# EAGLE design TeensyBreakout_Alpha2a (EAGLE 9.6.2)
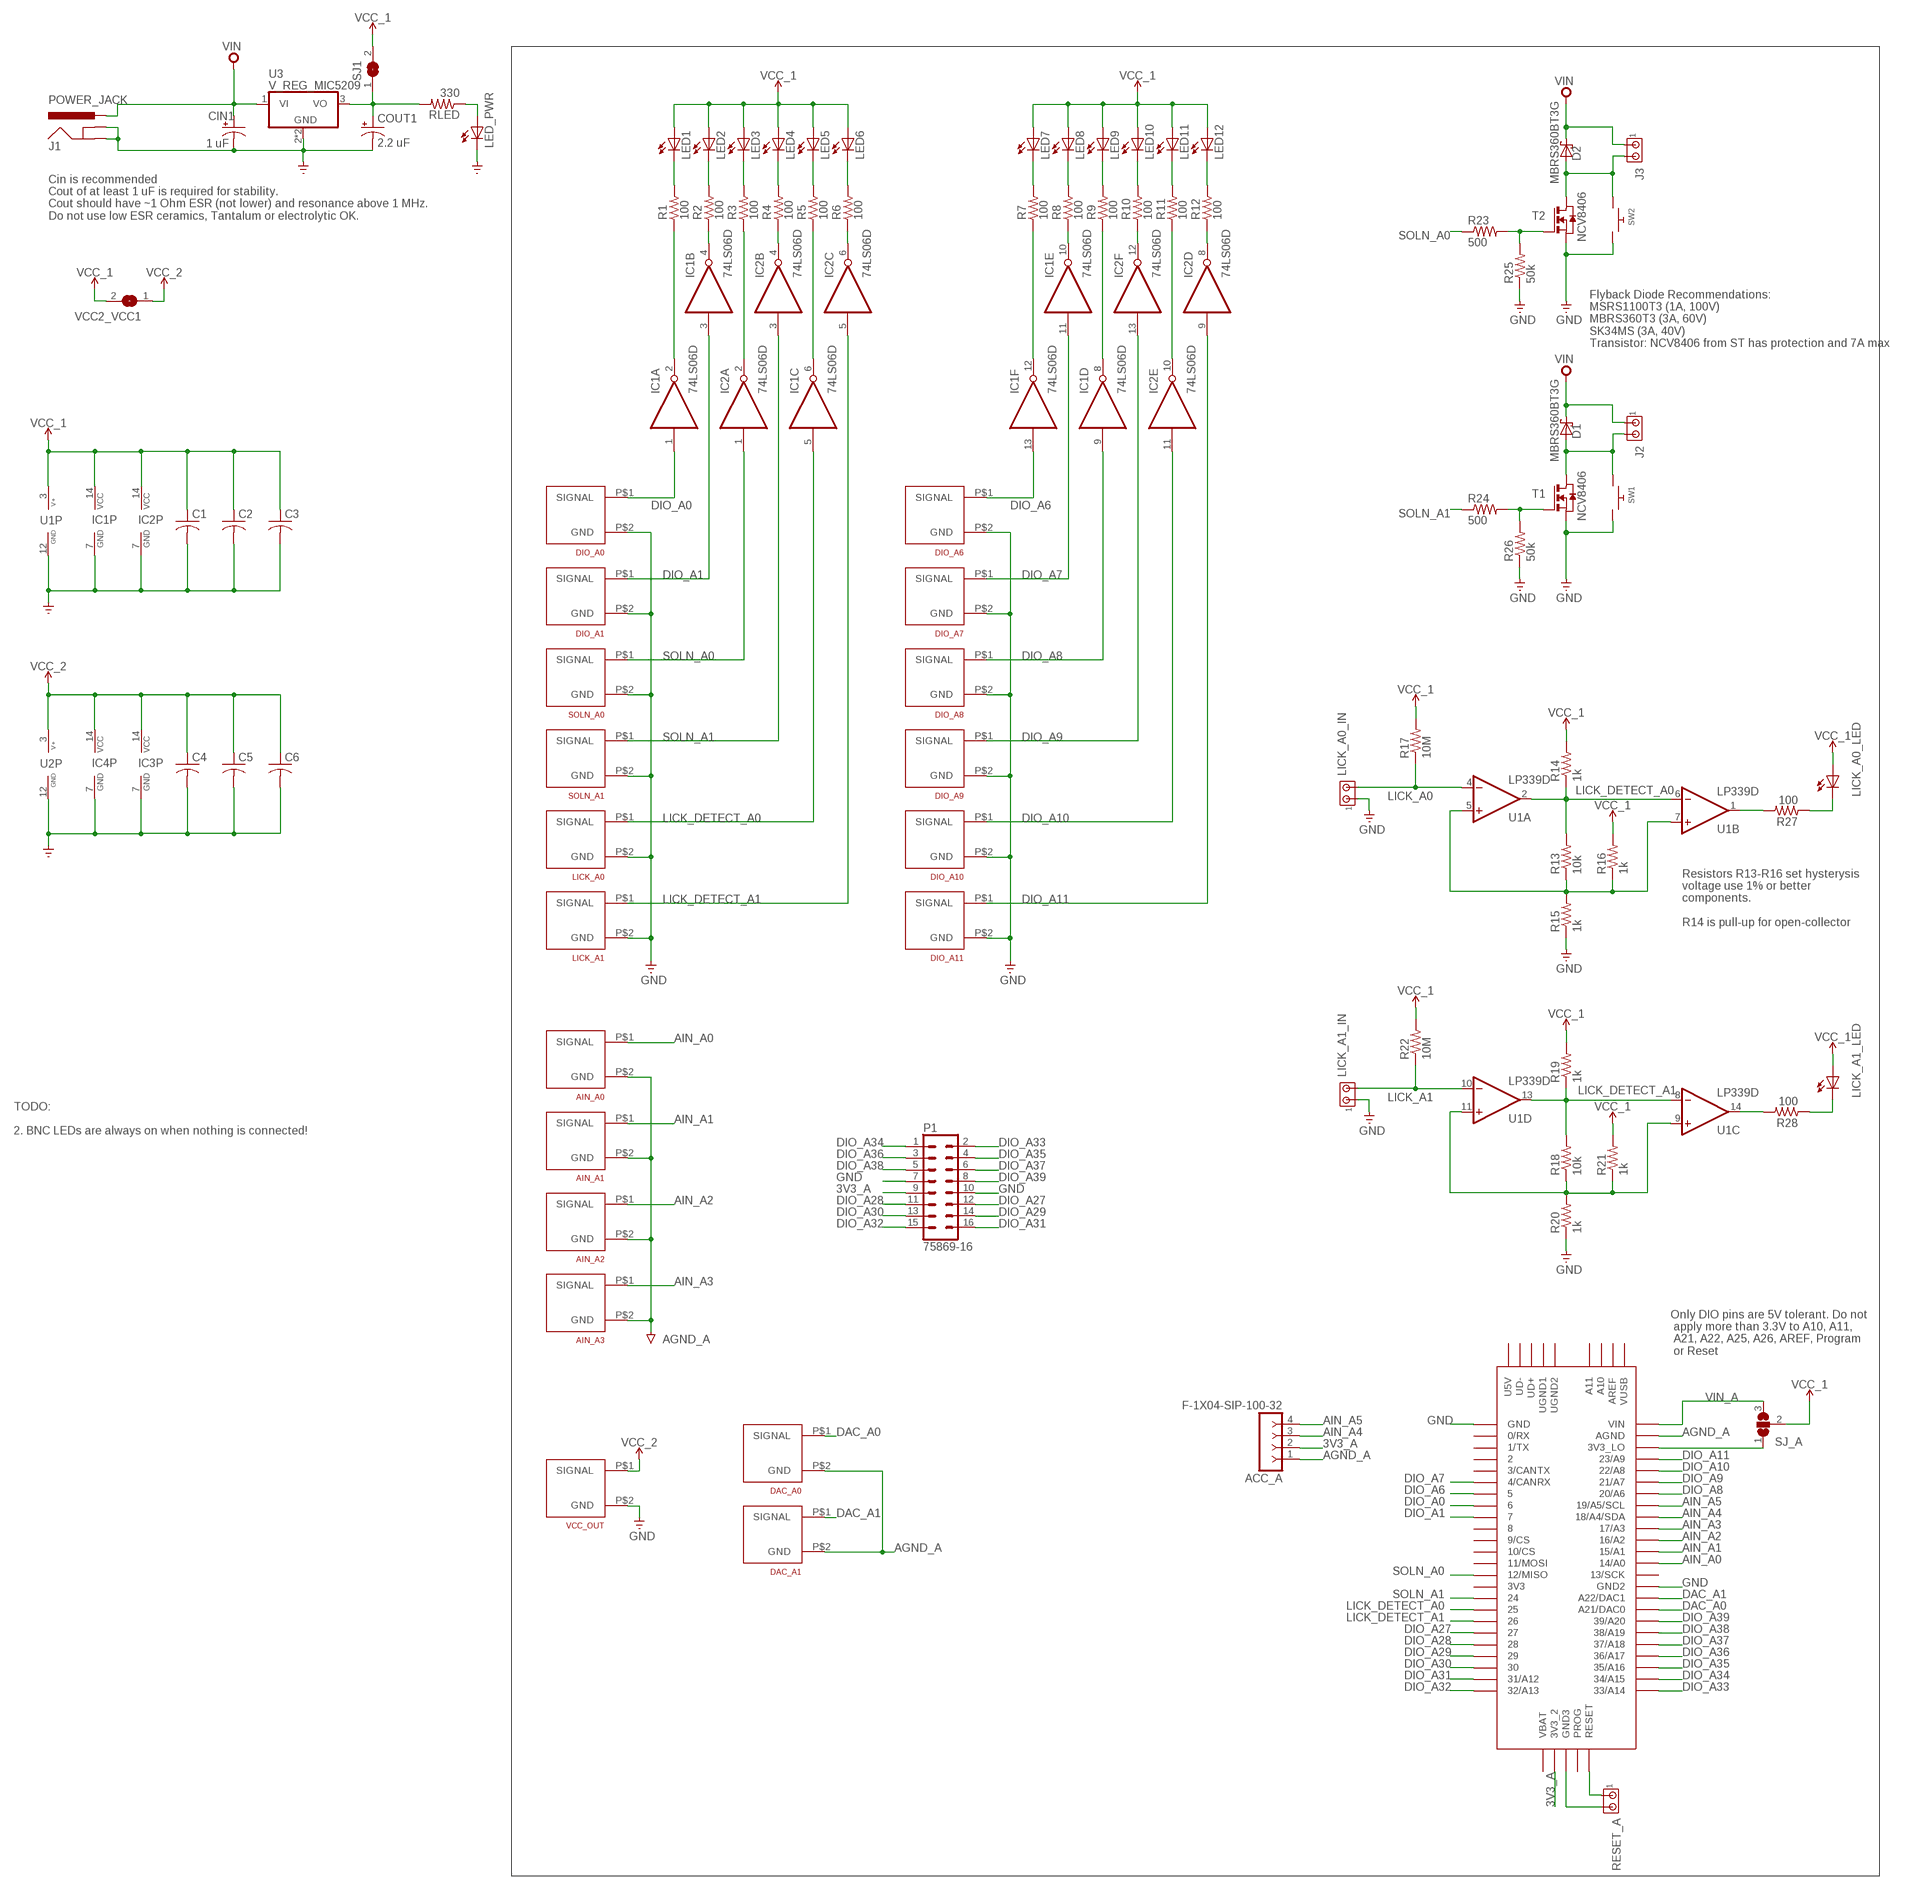
[diagram p0: schematic, sheet 1, part 1 of 2]
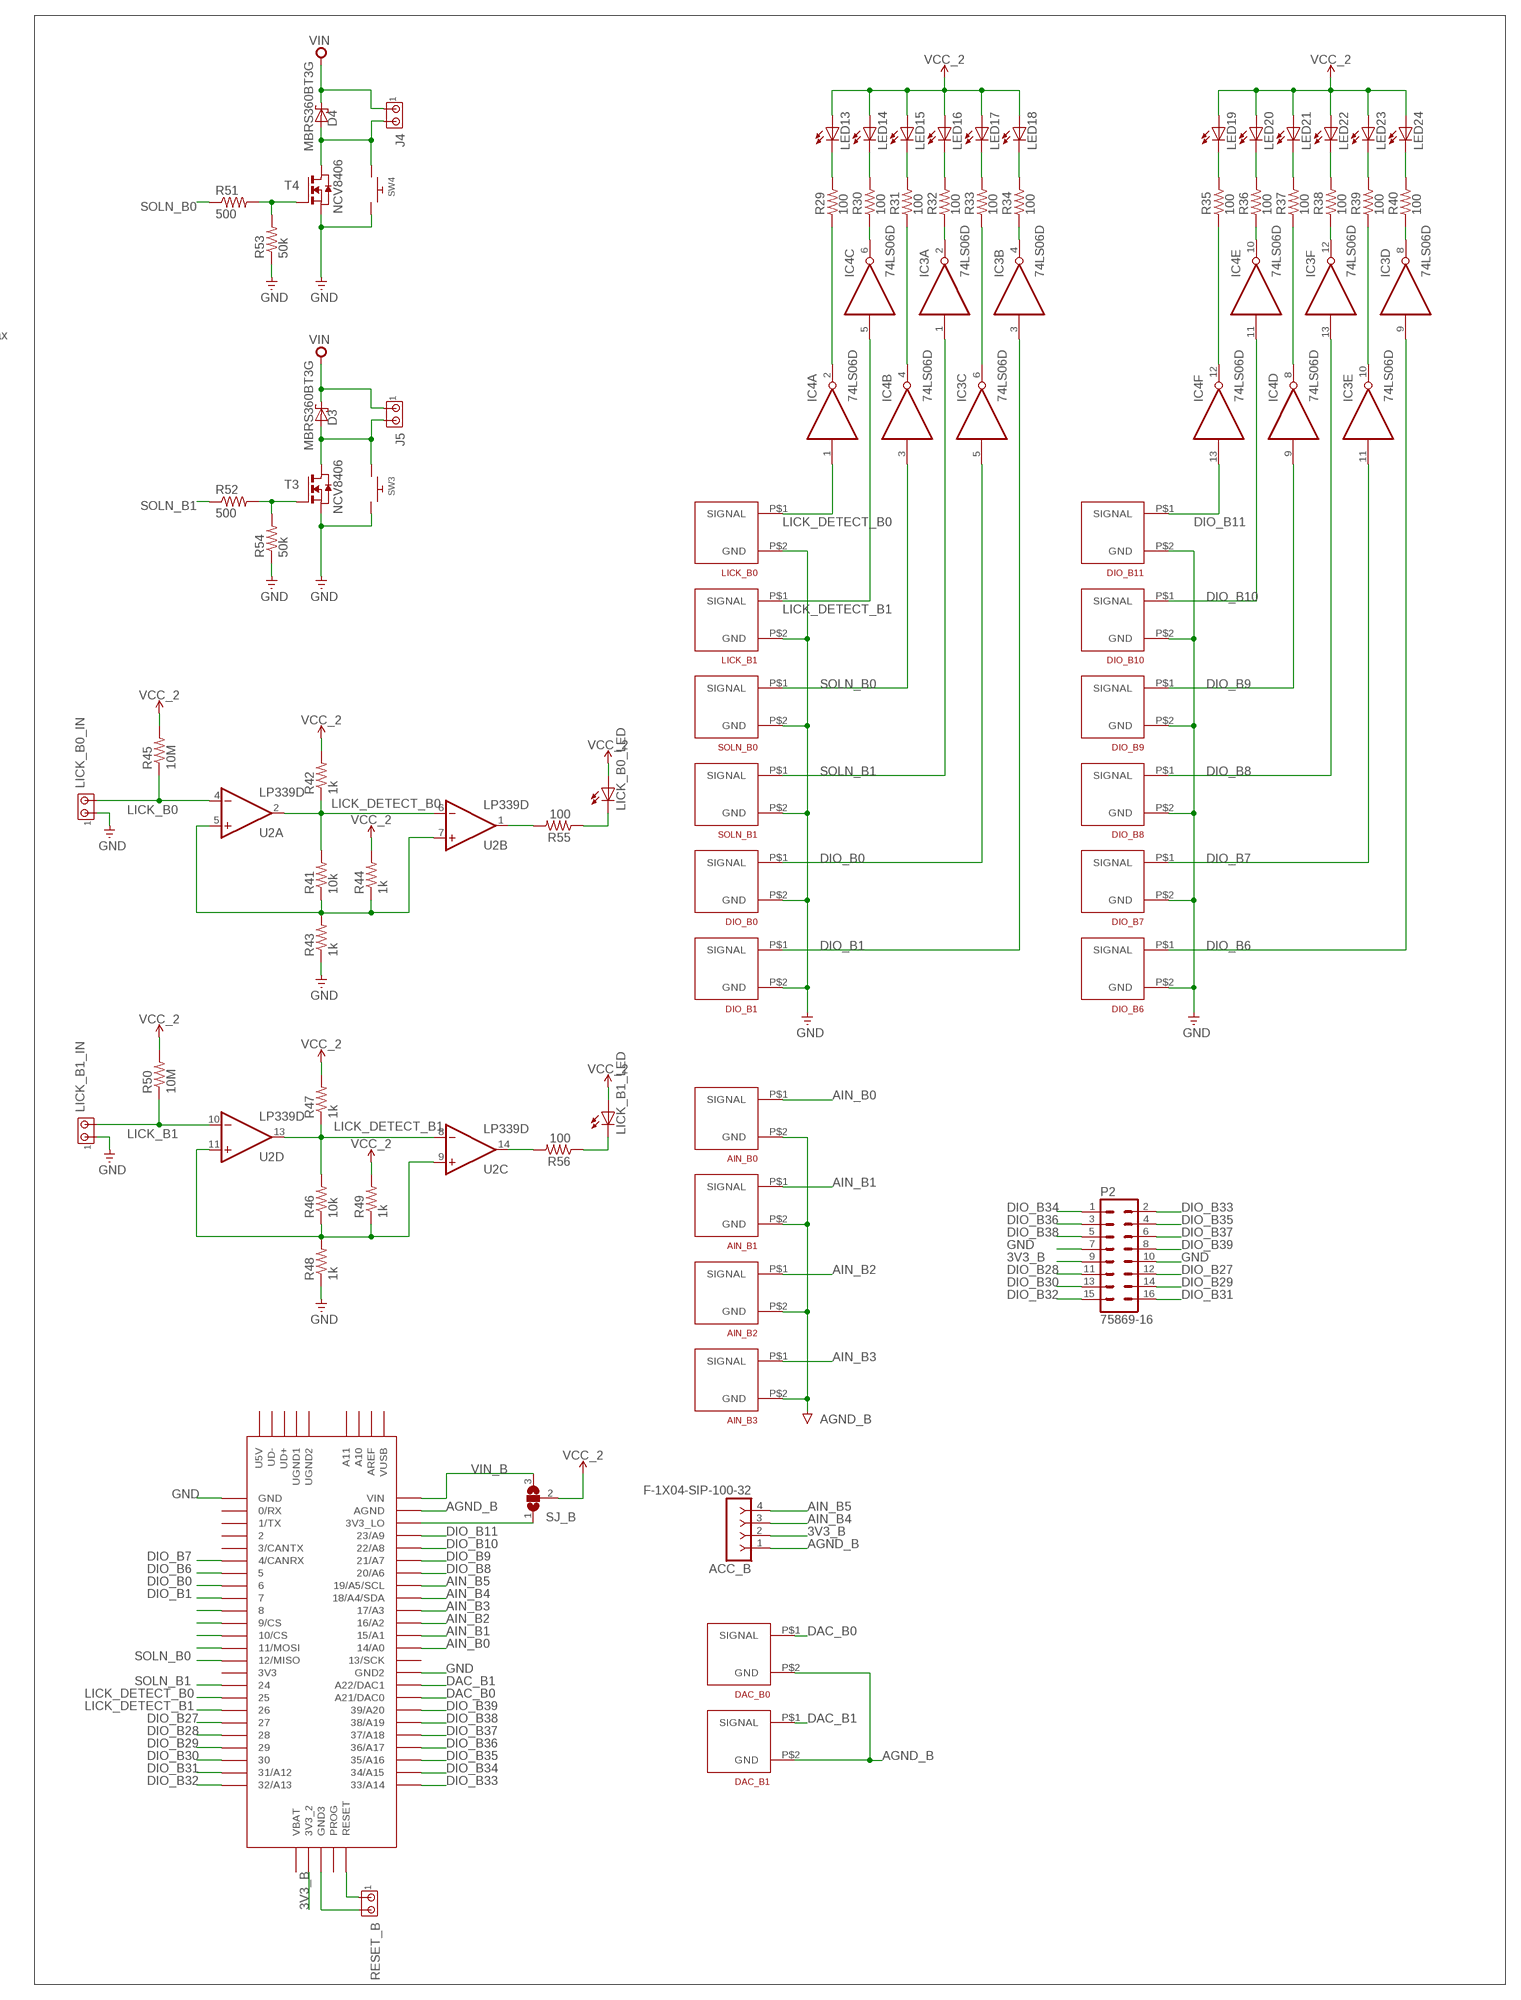
[diagram p1: schematic, sheet 1, part 2 of 2]

## Parts
ACC_A  F-1X04-SIP-100-32  [SIP-100-04-32]
ACC_B  F-1X04-SIP-100-32  [SIP-100-04-32]
AIN_A0  BNC_VERTICAL  [BNC_VERTICAL]
AIN_A1  BNC_VERTICAL  [BNC_VERTICAL]
AIN_A2  BNC_VERTICAL  [BNC_VERTICAL]
AIN_A3  BNC_VERTICAL  [BNC_VERTICAL]
AIN_B0  BNC_VERTICAL  [BNC_VERTICAL]
AIN_B1  BNC_VERTICAL  [BNC_VERTICAL]
AIN_B2  BNC_VERTICAL  [BNC_VERTICAL]
AIN_B3  BNC_VERTICAL  [BNC_VERTICAL]
C1  C-USC0805K  [C0805K]
C2  C-USC0805K  [C0805K]
C3  C-USC0805K  [C0805K]
C4  C-USC0805K  [C0805K]
C5  C-USC0805K  [C0805K]
C6  C-USC0805K  [C0805K]
CIN1  1 uF  CPOL-USE2.5-5  [E2,5-5]
COUT1  2.2 uF  CPOL-USE2.5-5  [E2,5-5]
D1  MBRS360BT3G  SCHOTTKY-DIODE  [DIODE_SMB]
D2  MBRS360BT3G  SCHOTTKY-DIODE  [DIODE_SMB]
D3  MBRS360BT3G  SCHOTTKY-DIODE  [DIODE_SMB]
D4  MBRS360BT3G  SCHOTTKY-DIODE  [DIODE_SMB]
DAC_A0  BNC_VERTICAL  [BNC_VERTICAL]
DAC_A1  BNC_VERTICAL  [BNC_VERTICAL]
DAC_B0  BNC_VERTICAL  [BNC_VERTICAL]
DAC_B1  BNC_VERTICAL  [BNC_VERTICAL]
DIO_A0  BNC_VERTICAL  [BNC_VERTICAL]
DIO_A1  BNC_VERTICAL  [BNC_VERTICAL]
DIO_A6  BNC_VERTICAL  [BNC_VERTICAL]
DIO_A7  BNC_VERTICAL  [BNC_VERTICAL]
DIO_A8  BNC_VERTICAL  [BNC_VERTICAL]
DIO_A9  BNC_VERTICAL  [BNC_VERTICAL]
DIO_A10  BNC_VERTICAL  [BNC_VERTICAL]
DIO_A11  BNC_VERTICAL  [BNC_VERTICAL]
DIO_B0  BNC_VERTICAL  [BNC_VERTICAL]
DIO_B1  BNC_VERTICAL  [BNC_VERTICAL]
DIO_B6  BNC_VERTICAL  [BNC_VERTICAL]
DIO_B7  BNC_VERTICAL  [BNC_VERTICAL]
DIO_B8  BNC_VERTICAL  [BNC_VERTICAL]
DIO_B9  BNC_VERTICAL  [BNC_VERTICAL]
DIO_B10  BNC_VERTICAL  [BNC_VERTICAL]
DIO_B11  BNC_VERTICAL  [BNC_VERTICAL]
IC1  74LS06D  [SO14]
IC2  74LS06D  [SO14]
IC3  74LS06D  [SO14]
IC4  74LS06D  [SO14]
J1  POWER_JACK  [POWER_JACK_PTH]
J2  MTA02-100  [10X02MTA]
J3  MTA02-100  [10X02MTA]
J4  MTA02-100  [10X02MTA]
J5  MTA02-100  [10X02MTA]
LED1  LED5MM  [LED5MM]
LED2  LED5MM  [LED5MM]
LED3  LED5MM  [LED5MM]
LED4  LED5MM  [LED5MM]
LED5  LED5MM  [LED5MM]
LED6  LED5MM  [LED5MM]
LED7  LED5MM  [LED5MM]
LED8  LED5MM  [LED5MM]
LED9  LED5MM  [LED5MM]
LED10  LED5MM  [LED5MM]
LED11  LED5MM  [LED5MM]
LED12  LED5MM  [LED5MM]
LED13  LED5MM  [LED5MM]
LED14  LED5MM  [LED5MM]
LED15  LED5MM  [LED5MM]
LED16  LED5MM  [LED5MM]
LED17  LED5MM  [LED5MM]
LED18  LED5MM  [LED5MM]
LED19  LED5MM  [LED5MM]
LED20  LED5MM  [LED5MM]
LED21  LED5MM  [LED5MM]
LED22  LED5MM  [LED5MM]
LED23  LED5MM  [LED5MM]
LED24  LED5MM  [LED5MM]
LED_PWR  LED5MM  [LED5MM]
LICK_A0  BNC_VERTICAL  [BNC_VERTICAL]
LICK_A0_IN  MTA02-100  [10X02MTA]
LICK_A0_LED  LED5MM  [LED5MM]
LICK_A1  BNC_VERTICAL  [BNC_VERTICAL]
LICK_A1_IN  MTA02-100  [10X02MTA]
LICK_A1_LED  LED5MM  [LED5MM]
LICK_B0  BNC_VERTICAL  [BNC_VERTICAL]
LICK_B0_IN  MTA02-100  [10X02MTA]
LICK_B0_LED  LED5MM  [LED5MM]
LICK_B1  BNC_VERTICAL  [BNC_VERTICAL]
LICK_B1_IN  MTA02-100  [10X02MTA]
LICK_B1_LED  LED5MM  [LED5MM]
P1  75869-16  [75869-16]
P2  75869-16  [75869-16]
R1  100  R_1206MP  [R1206MP]
R2  100  R_1206MP  [R1206MP]
R3  100  R_1206MP  [R1206MP]
R4  100  R_1206MP  [R1206MP]
R5  100  R_1206MP  [R1206MP]
R6  100  R_1206MP  [R1206MP]
R7  100  R_1206MP  [R1206MP]
R8  100  R_1206MP  [R1206MP]
R9  100  R_1206MP  [R1206MP]
R10  100  R_1206MP  [R1206MP]
R11  100  R_1206MP  [R1206MP]
R12  100  R_1206MP  [R1206MP]
R13  10k  R-US_M0805  [M0805]
R14  1k  R-US_M0805  [M0805]
R15  1k  R-US_M0805  [M0805]
R16  1k  R-US_M0805  [M0805]
R17  10M  R-US_M0805  [M0805]
R18  10k  R-US_M0805  [M0805]
R19  1k  R-US_M0805  [M0805]
R20  1k  R-US_M0805  [M0805]
R21  1k  R-US_M0805  [M0805]
R22  10M  R-US_M0805  [M0805]
R23  500  R-US_M1206  [M1206]
R24  500  R-US_M1206  [M1206]
R25  50k  R-US_M1206  [M1206]
R26  50k  R-US_M1206  [M1206]
R27  100  R_1206  [R1206]
R28  100  R_1206  [R1206]
R29  100  R_1206MP  [R1206MP]
R30  100  R_1206MP  [R1206MP]
R31  100  R_1206MP  [R1206MP]
R32  100  R_1206MP  [R1206MP]
R33  100  R_1206MP  [R1206MP]
R34  100  R_1206MP  [R1206MP]
R35  100  R_1206MP  [R1206MP]
R36  100  R_1206MP  [R1206MP]
R37  100  R_1206MP  [R1206MP]
R38  100  R_1206MP  [R1206MP]
R39  100  R_1206MP  [R1206MP]
R40  100  R_1206MP  [R1206MP]
R41  10k  R-US_M0805  [M0805]
R42  1k  R-US_M0805  [M0805]
R43  1k  R-US_M0805  [M0805]
R44  1k  R-US_M0805  [M0805]
R45  10M  R-US_M0805  [M0805]
R46  10k  R-US_M0805  [M0805]
R47  1k  R-US_M0805  [M0805]
R48  1k  R-US_M0805  [M0805]
R49  1k  R-US_M0805  [M0805]
R50  10M  R-US_M0805  [M0805]
R51  500  R-US_M1206  [M1206]
R52  500  R-US_M1206  [M1206]
R53  50k  R-US_M1206  [M1206]
R54  50k  R-US_M1206  [M1206]
R55  100  R_1206  [R1206]
R56  100  R_1206  [R1206]
RESET_A  MTA02-100  [10X02MTA]
RESET_B  MTA02-100  [10X02MTA]
RLED  330  R-US_R0805  [R0805]
SJ1  SJ  [SJ]
SJ_A  SJ2W  [SJ_2]
SJ_B  SJ2W  [SJ_2]
SOLN_A0  BNC_VERTICAL  [BNC_VERTICAL]
SOLN_A1  BNC_VERTICAL  [BNC_VERTICAL]
SOLN_B0  BNC_VERTICAL  [BNC_VERTICAL]
SOLN_B1  BNC_VERTICAL  [BNC_VERTICAL]
SW1  SWITCH_PUSHBUTTONEVQ-PE  [TACT_PANA-EVQ]
SW2  SWITCH_PUSHBUTTONEVQ-PE  [TACT_PANA-EVQ]
SW3  SWITCH_PUSHBUTTONEVQ-PE  [TACT_PANA-EVQ]
SW4  SWITCH_PUSHBUTTONEVQ-PE  [TACT_PANA-EVQ]
T1  NCV8406  NMOSSOT223  [SOT223]
T2  NCV8406  NMOSSOT223  [SOT223]
T3  NCV8406  NMOSSOT223  [SOT223]
T4  NCV8406  NMOSSOT223  [SOT223]
TEENSY_A  TEENSY_3.5/3.6  [TEENSY_3.5/3.6]
TEENSY_B  TEENSY_3.5/3.6  [TEENSY_3.5/3.6]
U1  LP339D  LM339D  [SO14]
U2  LP339D  LM339D  [SO14]
U3  V_REG_MIC5209  [SOT-223]
VCC2_VCC1  SJW  [SJW]
VCC_OUT  BNC_VERTICAL  [BNC_VERTICAL]

## Nets
3V3_A: ACC_A.2 P1.9 TEENSY_A.3V3_2
3V3_B: ACC_B.2 P2.9 TEENSY_B.3V3_2
AGND_A: ACC_A.1 AIN_A0.P$2(GND) AIN_A1.P$2(GND) AIN_A2.P$2(GND) AIN_A3.P$2(GND) DAC_A0.P$2(GND) DAC_A1.P$2(GND) TEENSY_A.AGND ; supply symbol labelled AGND
AGND_B: ACC_B.1 AIN_B0.P$2(GND) AIN_B1.P$2(GND) AIN_B2.P$2(GND) AIN_B3.P$2(GND) DAC_B0.P$2(GND) DAC_B1.P$2(GND) TEENSY_B.AGND ; supply symbol labelled AGND
AIN_A0: AIN_A0.P$1(SIGNAL) TEENSY_A.14/A0
AIN_A1: AIN_A1.P$1(SIGNAL) TEENSY_A.15/A1
AIN_A2: AIN_A2.P$1(SIGNAL) TEENSY_A.16/A2
AIN_A3: AIN_A3.P$1(SIGNAL) TEENSY_A.17/A3
AIN_A4: ACC_A.3 TEENSY_A.18/A4/SDA
AIN_A5: ACC_A.4 TEENSY_A.19/A5/SCL
AIN_B0: AIN_B0.P$1(SIGNAL) TEENSY_B.14/A0
AIN_B1: AIN_B1.P$1(SIGNAL) TEENSY_B.15/A1
AIN_B2: AIN_B2.P$1(SIGNAL) TEENSY_B.16/A2
AIN_B3: AIN_B3.P$1(SIGNAL) TEENSY_B.17/A3
AIN_B4: ACC_B.3 TEENSY_B.18/A4/SDA
AIN_B5: ACC_B.4 TEENSY_B.19/A5/SCL
DAC_A0: DAC_A0.P$1(SIGNAL) TEENSY_A.21/DAC0(A21/DAC0)
DAC_A1: DAC_A1.P$1(SIGNAL) TEENSY_A.A22/DAC1
DAC_B0: DAC_B0.P$1(SIGNAL) TEENSY_B.21/DAC0(A21/DAC0)
DAC_B1: DAC_B1.P$1(SIGNAL) TEENSY_B.A22/DAC1
DIO_A0: DIO_A0.P$1(SIGNAL) IC1.1(A:I) TEENSY_A.6
DIO_A1: DIO_A1.P$1(SIGNAL) IC1.3(B:I) TEENSY_A.7
DIO_A6: DIO_A6.P$1(SIGNAL) IC1.13(F:I) TEENSY_A.5
DIO_A7: DIO_A7.P$1(SIGNAL) IC1.11(E:I) TEENSY_A.4/CANRX
DIO_A8: DIO_A8.P$1(SIGNAL) IC1.9(D:I) TEENSY_A.20/A6
DIO_A9: DIO_A9.P$1(SIGNAL) IC2.13(F:I) TEENSY_A.21/A7
DIO_A10: DIO_A10.P$1(SIGNAL) IC2.11(E:I) TEENSY_A.22/A8
DIO_A11: DIO_A11.P$1(SIGNAL) IC2.9(D:I) TEENSY_A.23/A9
DIO_A27: P1.12 TEENSY_A.27
DIO_A28: P1.11 TEENSY_A.28
DIO_A29: P1.14 TEENSY_A.29
DIO_A30: P1.13 TEENSY_A.30
DIO_A31: P1.16 TEENSY_A.31/A12
DIO_A32: P1.15 TEENSY_A.32/A13
DIO_A33: P1.2 TEENSY_A.33/A14
DIO_A34: P1.1 TEENSY_A.34/A15
DIO_A35: P1.4 TEENSY_A.35/A16
DIO_A36: P1.3 TEENSY_A.36/A17
DIO_A37: P1.6 TEENSY_A.37/A18
DIO_A38: P1.5 TEENSY_A.38/A19
DIO_A39: P1.8 TEENSY_A.39/A20
DIO_B0: DIO_B0.P$1(SIGNAL) IC3.5(C:I) TEENSY_B.6
DIO_B1: DIO_B1.P$1(SIGNAL) IC3.3(B:I) TEENSY_B.7
DIO_B6: DIO_B6.P$1(SIGNAL) IC3.9(D:I) TEENSY_B.5
DIO_B7: DIO_B7.P$1(SIGNAL) IC3.11(E:I) TEENSY_B.4/CANRX
DIO_B8: DIO_B8.P$1(SIGNAL) IC3.13(F:I) TEENSY_B.20/A6
DIO_B9: DIO_B9.P$1(SIGNAL) IC4.9(D:I) TEENSY_B.21/A7
DIO_B10: DIO_B10.P$1(SIGNAL) IC4.11(E:I) TEENSY_B.22/A8
DIO_B11: DIO_B11.P$1(SIGNAL) IC4.13(F:I) TEENSY_B.23/A9
DIO_B27: P2.12 TEENSY_B.27
DIO_B28: P2.11 TEENSY_B.28
DIO_B29: P2.14 TEENSY_B.29
DIO_B30: P2.13 TEENSY_B.30
DIO_B31: P2.16 TEENSY_B.31/A12
DIO_B32: P2.15 TEENSY_B.32/A13
DIO_B33: P2.2 TEENSY_B.33/A14
DIO_B34: P2.1 TEENSY_B.34/A15
DIO_B35: P2.4 TEENSY_B.35/A16
DIO_B36: P2.3 TEENSY_B.36/A17
DIO_B37: P2.6 TEENSY_B.37/A18
DIO_B38: P2.5 TEENSY_B.38/A19
DIO_B39: P2.8 TEENSY_B.39/A20
GND: C1.2 C2.2 C3.2 C4.2 C5.2 C6.2 CIN1.- COUT1.- DIO_A0.P$2(GND) DIO_A1.P$2(GND) DIO_A6.P$2(GND) DIO_A7.P$2(GND) DIO_A8.P$2(GND) DIO_A9.P$2(GND) DIO_A10.P$2(GND) DIO_A11.P$2(GND) DIO_B0.P$2(GND) DIO_B1.P$2(GND) DIO_B6.P$2(GND) DIO_B7.P$2(GND) DIO_B8.P$2(GND) DIO_B9.P$2(GND) DIO_B10.P$2(GND) DIO_B11.P$2(GND) IC1.7(P:GND) IC2.7(P:GND) IC3.7(P:GND) IC4.7(P:GND) J1.GND J1.GNDBREAK LED_PWR.K(C) LICK_A0.P$2(GND) LICK_A0_IN.1 LICK_A1.P$2(GND) LICK_A1_IN.1 LICK_B0.P$2(GND) LICK_B0_IN.1 LICK_B1.P$2(GND) LICK_B1_IN.1 P1.7 P1.10 P2.7 P2.10 R15.1 R20.1 R25.1 R26.1 R43.1 R48.1 R53.1 R54.1 RESET_A.2 RESET_B.2 SOLN_A0.P$2(GND) SOLN_A1.P$2(GND) SOLN_B0.P$2(GND) SOLN_B1.P$2(GND) SW1.P$2 SW2.P$2 SW3.P$2 SW4.P$2 T1.3(S) T2.3(S) T3.3(S) T4.3(S) TEENSY_A.GND TEENSY_A.GND2 TEENSY_A.GND3 TEENSY_B.GND TEENSY_B.GND2 TEENSY_B.GND3 U1.12(P:GND) U2.12(P:GND) U3.2(GND) U3.4(GND) VCC_OUT.P$2(GND)
LICK_A0: LICK_A0_IN.2 R17.1 U1.4(A:-IN)
LICK_A1: LICK_A1_IN.2 R22.1 U1.10(D:-IN)
LICK_B0: LICK_B0_IN.2 R45.1 U2.4(A:-IN)
LICK_B1: LICK_B1_IN.2 R50.1 U2.10(D:-IN)
LICK_DETECT_A0: IC1.5(C:I) LICK_A0.P$1(SIGNAL) R13.2 R14.1 TEENSY_A.25 U1.2(A:OUT) U1.6(B:-IN)
LICK_DETECT_A1: IC2.5(C:I) LICK_A1.P$1(SIGNAL) R18.2 R19.1 TEENSY_A.26 U1.8(C:-IN) U1.13(D:OUT)
LICK_DETECT_B0: IC4.1(A:I) LICK_B0.P$1(SIGNAL) R41.2 R42.1 TEENSY_B.25 U2.2(A:OUT) U2.6(B:-IN)
LICK_DETECT_B1: IC4.5(C:I) LICK_B1.P$1(SIGNAL) R46.2 R47.1 TEENSY_B.26 U2.8(C:-IN) U2.13(D:OUT)
N$1: IC1.2(A:O) R1.1
N$2: IC1.4(B:O) R2.1
N$3: IC2.4(B:O) R4.1
N$4: IC2.2(A:O) R3.1
N$5: IC1.6(C:O) R5.1
N$6: IC2.6(C:O) R6.1
N$7: LED1.K(C) R1.2
N$8: LED2.K(C) R2.2
N$9: LED3.K(C) R3.2
N$10: LED4.K(C) R4.2
N$11: LED5.K(C) R5.2
N$12: LED6.K(C) R6.2
N$13: R18.1 R20.2 R21.1 U1.9(C:+IN) U1.11(D:+IN)
N$14: LED_PWR.A RLED.1
N$15: IC1.12(F:O) R7.1
N$16: IC1.10(E:O) R8.1
N$17: IC1.8(D:O) R9.1
N$18: IC2.12(F:O) R10.1
N$19: IC2.10(E:O) R11.1
N$20: IC2.8(D:O) R12.1
N$21: LED7.K(C) R7.2
N$22: LED8.K(C) R8.2
N$23: LED9.K(C) R9.2
N$24: LED10.K(C) R10.2
N$25: LED11.K(C) R11.2
N$26: LED12.K(C) R12.2
N$27: R13.1 R15.2 R16.1 U1.5(A:+IN) U1.7(B:+IN)
N$28: SJ_A.1 TEENSY_A.3V3_LO
N$29: TEENSY_B.8
N$30: COUT1.+ RLED.2 SJ1.1 U3.3(VO)
N$31: R23.2 R25.2 T2.1(G)
N$32: R27.2 U1.1(B:OUT)
N$33: R24.2 R26.2 T1.1(G)
N$34: TEENSY_B.9/CS
N$35: LICK_A0_LED.K(C) R27.1
N$36: TEENSY_B.10/CS
N$37: TEENSY_B.11/MOSI
N$38: IC4.4(B:O) R31.1
N$39: IC4.6(C:O) R30.1
N$40: IC3.6(C:O) R33.1
N$41: LICK_A1_LED.K(C) R28.1
N$42: IC3.4(B:O) R34.1
N$44: R28.2 U1.14(C:OUT)
N$46: SJ_B.1 TEENSY_B.3V3_LO
N$93: IC3.2(A:O) R32.1
N$96: LED14.K(C) R30.2
N$97: LED15.K(C) R31.2
N$98: LED16.K(C) R32.2
N$99: LED17.K(C) R33.2
N$100: LED18.K(C) R34.2
N$102: IC4.12(F:O) R35.1
N$103: IC4.10(E:O) R36.1
N$104: IC4.8(D:O) R37.1
N$105: IC3.12(F:O) R38.1
N$106: IC3.10(E:O) R39.1
N$107: IC3.8(D:O) R40.1
N$108: LED19.K(C) R35.2
N$109: LED20.K(C) R36.2
N$110: LED21.K(C) R37.2
N$111: LED22.K(C) R38.2
N$112: LED23.K(C) R39.2
N$113: LED24.K(C) R40.2
N$115: R51.2 R53.2 T4.1(G)
N$116: R52.2 R54.2 T3.1(G)
N$117: IC4.2(A:O) R29.1
N$118: LED13.K(C) R29.2
N$119: R41.1 R43.2 R44.1 U2.5(A:+IN) U2.7(B:+IN)
N$128: R46.1 R48.2 R49.1 U2.9(C:+IN) U2.11(D:+IN)
N$132: R55.2 U2.1(B:OUT)
N$133: LICK_B0_LED.K(C) R55.1
N$134: LICK_B1_LED.K(C) R56.1
N$135: R56.2 U2.14(C:OUT)
RESET_A: RESET_A.1 TEENSY_A.RESET
RESET_B: RESET_B.1 TEENSY_B.RESET
SOLN_A0: IC2.1(A:I) R23.1 SOLN_A0.P$1(SIGNAL) TEENSY_A.12/MISO
SOLN_A1: IC2.3(B:I) R24.1 SOLN_A1.P$1(SIGNAL) TEENSY_A.24
SOLN_B0: IC4.3(B:I) R51.1 SOLN_B0.P$1(SIGNAL) TEENSY_B.12/MISO
SOLN_B1: IC3.1(A:I) R52.1 SOLN_B1.P$1(SIGNAL) TEENSY_B.24
VCC_1: C1.1 C2.1 C3.1 IC1.14(P:VCC) IC2.14(P:VCC) LED1.A LED2.A LED3.A LED4.A LED5.A LED6.A LED7.A LED8.A LED9.A LED10.A LED11.A LED12.A LICK_A0_LED.A LICK_A1_LED.A R14.2 R16.2 R17.2 R19.2 R21.2 R22.2 SJ1.2 SJ_A.2 U1.3(P:V+) VCC2_VCC1.2
VCC_2: C4.1 C5.1 C6.1 IC3.14(P:VCC) IC4.14(P:VCC) LED13.A LED14.A LED15.A LED16.A LED17.A LED18.A LED19.A LED20.A LED21.A LED22.A LED23.A LED24.A LICK_B0_LED.A LICK_B1_LED.A R42.2 R44.2 R45.2 R47.2 R49.2 R50.2 SJ_B.2 U2.3(P:V+) VCC2_VCC1.1 VCC_OUT.P$1(SIGNAL)
VIN: CIN1.+ D1.C(A) D2.C(A) D3.C(A) D4.C(A) J1.PWR J2.1 J3.1 J4.1 J5.1 U3.1(VI)
VIN_A: SJ_A.3 TEENSY_A.VIN
VIN_B: SJ_B.3 TEENSY_B.VIN
VOUT-2: D1.A(C) J2.2 SW1.P$1 T1.2(D) T1.4(D)
VOUT-3: D2.A(C) J3.2 SW2.P$1 T2.2(D) T2.4(D)
VOUT-5: D4.A(C) J4.2 SW4.P$1 T4.2(D) T4.4(D)
VOUT-6: D3.A(C) J5.2 SW3.P$1 T3.2(D) T3.4(D)
Unconnected: TEENSY_A.0/RX TEENSY_A.1/TX TEENSY_A.2 TEENSY_A.3/CANTX TEENSY_A.3V3 TEENSY_A.8 TEENSY_A.9/CS TEENSY_A.10/CS TEENSY_A.11/MOSI TEENSY_A.13/SCK TEENSY_A.A10 TEENSY_A.A11 TEENSY_A.AREF TEENSY_A.PROG TEENSY_A.U5V TEENSY_A.UD+ TEENSY_A.UD- TEENSY_A.UGND1 TEENSY_A.UGND2 TEENSY_A.VBAT TEENSY_A.VUSB TEENSY_B.0/RX TEENSY_B.1/TX TEENSY_B.2 TEENSY_B.3/CANTX TEENSY_B.3V3 TEENSY_B.13/SCK TEENSY_B.A10 TEENSY_B.A11 TEENSY_B.AREF TEENSY_B.PROG TEENSY_B.U5V TEENSY_B.UD+ TEENSY_B.UD- TEENSY_B.UGND1 TEENSY_B.UGND2 TEENSY_B.VBAT TEENSY_B.VUSB

## Notes on the sheet
- Cin is recommended
  Cout of at least 1 uF is required for stability. 
  Cout should have ~1 Ohm ESR (not lower) and resonance above 1 MHz. 
  Do not use low ESR ceramics, Tantalum or electrolytic OK.
- Flyback Diode Recommendations:
  MSRS1100T3 (1A, 100V)
  MBRS360T3 (3A, 60V)
  SK34MS (3A, 40V)
  Transistor: NCV8406 from ST has protection and 7A max
- Resistors R13-R16 set hysterysis
  voltage use 1% or better
  components.
  
  R14 is pull-up for open-collector
- TODO:
  
  2. BNC LEDs are always on when nothing is connected!
- Only DIO pins are 5V tolerant. Do not
   apply more than 3.3V to A10, A11,
   A21, A22, A25, A26, AREF, Program
   or Reset

## Library data of the parts
ACC_A ACC_B = con-headers-jp:F-1X04-: FEMALE HEADER
AIN_A0 AIN_A1-AIN_A3 AIN_B0 AIN_B1-AIN_B3 DAC_A0 DAC_A1 DAC_B0 DAC_B1 DIO_A0 DIO_A1 DIO_A6-DIO_A11 DIO_B0 DIO_B1 DIO_B6-DIO_B11 LICK_A0 LICK_A1 LICK_B0 LICK_B1 SOLN_A0 SOLN_A1 SOLN_B0 SOLN_B1 VCC_OUT = connectors:BNC_VERTICAL: BNC plug, through-hole, vertical
C1-C6 = rcl:C-US: CAPACITOR, American symbol; SPICEPREFIX: C
CIN1 COUT1 = adafruit:CPOL-US: POLARIZED CAPACITOR, American symbol
D1-D4 = eagle-ltspice:SCHOTTKY-DIODE: Schottky Diode; SPICEMODEL: NONE; SPICEPREFIX: D; SPICETYPE: diode
IC1-IC4 = 74xx-eu:74*06: Hex INVERTER, open collector high-voltage output
J1 = SparkFun-Connectors:POWER_JACK: Power Jack Connector This is the standard 5.5mm barrel jack for power. The PTH is the most common, proven, reliable, footprint. The Slot footprint only works if the mill layer is transmitted to the PCB fab house so be warned. Here are the connectors we sell at SparkFun: DC Barrel Power Jack/Connector <https://www.sparkfun.com/products/119> (PRT-00119) DC Barrel Power Jack/Connector (SMD) <https://www.sparkfun.com/products/12748> (PRT-12748) DC Barrel Jack Adapter - Breadboard Compatible <https://www.sparkfun.com/products/10811> (PRT-10811) It is used on this SparkFun product (and many, many others): SparkFun RedBoard - Programmed with Arduino <https://www.sparkfun.com/products/12757> (DEV-12757) Also, if you need a mating power supply or connector, please check these out: Wall Adapter Power Supply - 9VDC 650mA <https://www.sparkfun.com/products/298> (TOL-00298) DC Barrel Jack Adapter - Male <https://www.sparkfun.com/products/10287> (PRT-10287); PROD_ID: CONN-08197
J2-J5 LICK_A0_IN LICK_A1_IN LICK_B0_IN LICK_B1_IN RESET_A RESET_B = con-amp:MTA02-100: AMP connector
LED1-LED24 LED_PWR LICK_A0_LED LICK_A1_LED LICK_B0_LED LICK_B1_LED = adafruit:LED: LED OSRAM: - CHIPLED LG R971, LG N971, LY N971, LG Q971, LY Q971, LO R971, LY R971 LH N974, LH R974 LS Q976, LO Q976, LY Q976 LO Q996 - Hyper CHIPLED LW Q18S LB Q993, LB Q99A, LB R99A - SideLED LS A670, LO A670, LY A670, LG A670, LP A670 LB A673, LV A673, LT A673, LW A673 LH A674 LY A675 LS A676, LA A676, LO A676, LY A676, LW A676 LS A679, LY A679, LG A679 - Hyper Micro SIDELED® LS Y876, LA Y876, LO Y876, LY Y876 LT Y87S - SmartLED LW L88C, LW L88S LB L89C, LB L89S, LG L890 LS L89K, LO L89K, LY L89K LS L896, LA L896, LO L896, LY L896 - TOPLED LS T670, LO T670, LY T670, LG T670, LP T670 LSG T670, LSP T670, LSY T670, LOP T670, LYG T670 LG T671, LOG T671, LSG T671 LB T673, LV T673, LT T673, LW T673 LH T674 LS T676, LA T676, LO T676, LY T676, LB T676, LH T676, LSB T676, LW T676 LB T67C, LV T67C, LT T67C, LS T67K, LO T67K, LY T67K, LW E67C LS E67B, LA E67B, LO E67B, LY E67B, LB E67C, LV E67C, LT E67C LW T67C LS T679, LY T679, LG T679 LS T770, LO T770, LY T770, LG T770, LP T770 LB T773, LV T773, LT T773, LW T773 LH T774 LS E675, LA E675, LY E675, LS T675 LS T776, LA T776, LO T776, LY T776, LB T776 LHGB T686 LT T68C, LB T68C - Hyper Mini TOPLED® LB M676 - Mini TOPLED Santana® LG M470 LS M47K, LO M47K, LY M47K Source: http://www.osram.convergy.de/
P1 P2 = con-fci-quickie:75869-16: HEADER
R1-R12 R27-R40 R55 R56 = rc-master:R_: RESISTOR
R13-R26 R41-R54 = adafruit:R-US_: RESISTOR, American symbol
RLED = rcl:R-US_: RESISTOR, American symbol; SPICEPREFIX: R
SJ1 VCC2_VCC1 = jumper:SJ: SMD solder JUMPER
SJ_A SJ_B = jumper:SJ2W: SMD solder JUMPER
SW1-SW4 = adafruit:SWITCH_PUSHBUTTON: Buttons SOFTTOUCHSMD_SJ - Soft touch temporary push button (Super Junk Akihabara) Compatible with SKPMANE010 [Mouser: 688-SKPMAN] C&K_KSS = Digikey: KSS221GLFS
T1-T4 = zetex:NMOSSOT223: MOS FET; OC_FARNELL: unknown; OC_NEWARK: unknown
TEENSY_A TEENSY_B = Teensy356:TEENSY_3.5/3.6
U1 U2 = op-amp:LM339: COMPARATOR - Quad Low Power Low Offset Voltage with open collector; LM139/LM239/LM339/LM2901/LM3302
U3 = Pavel-PowerIC:V_REG_MIC5209

## Board
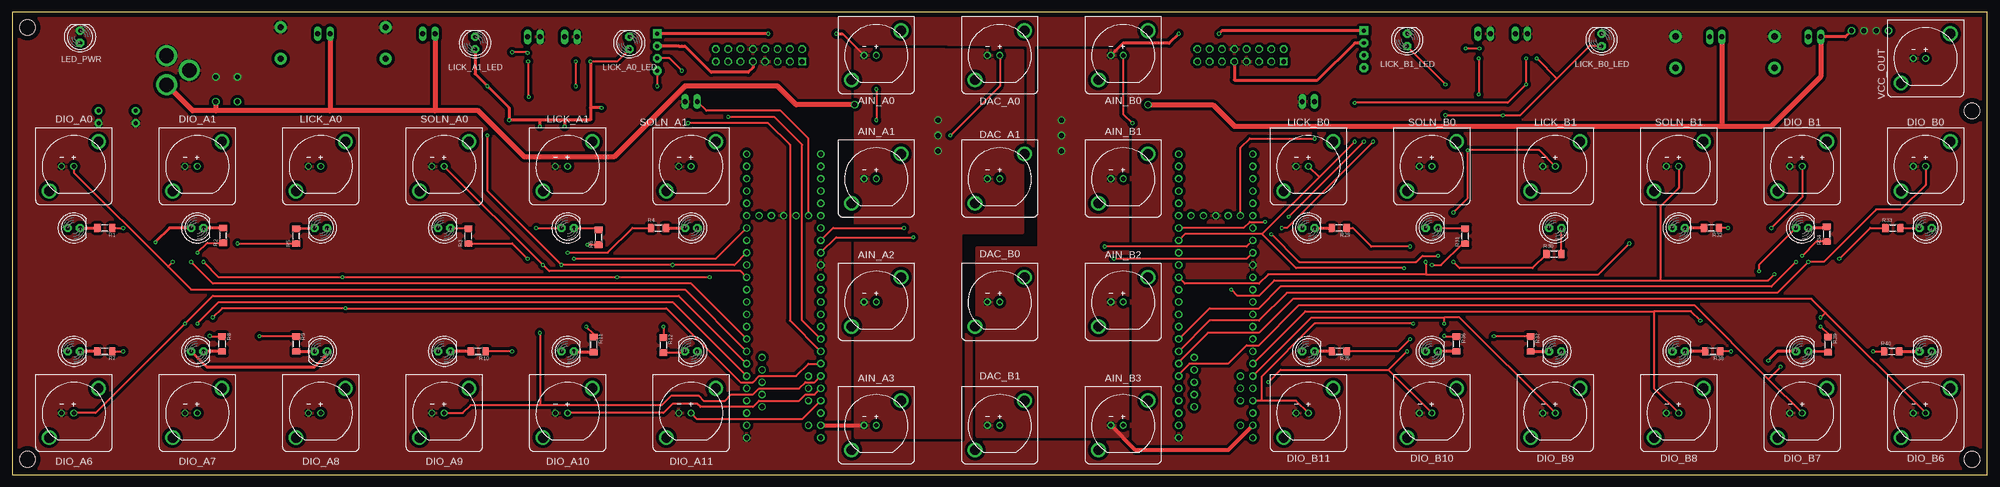
[diagram p2: board, top side]
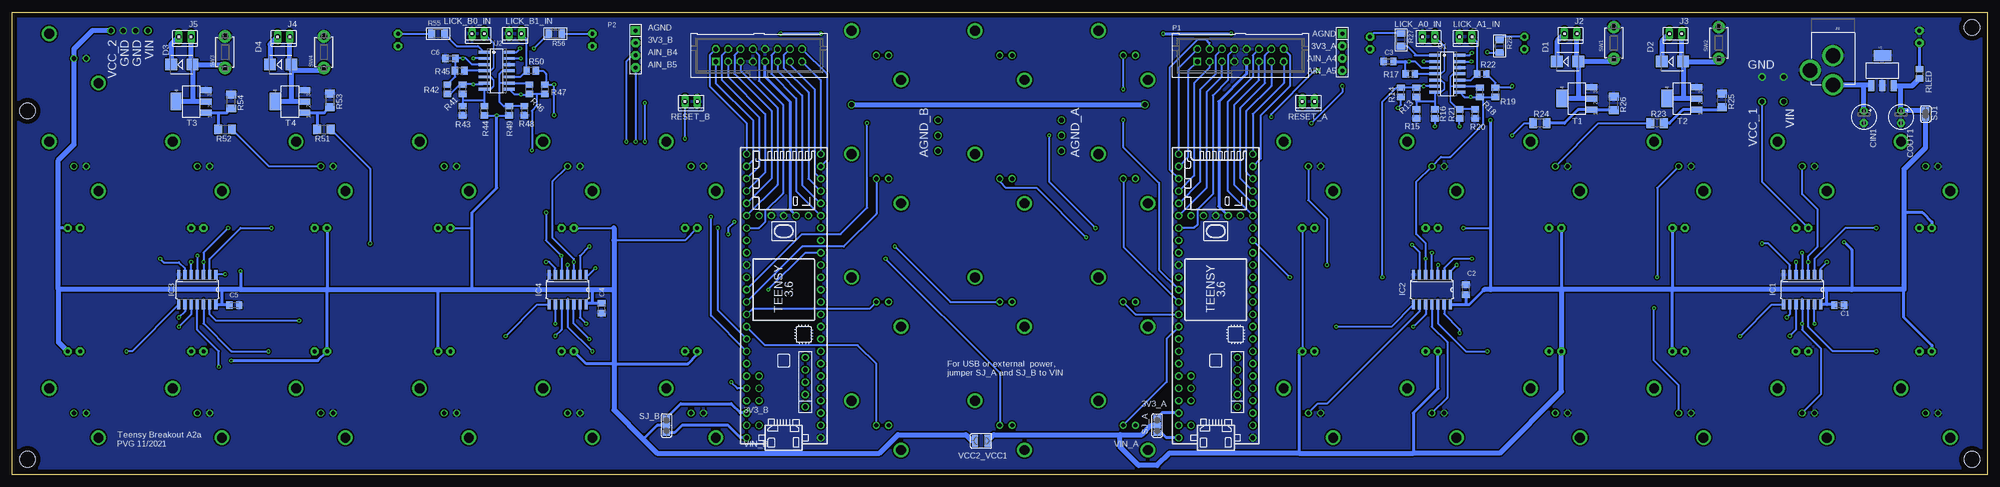
[diagram p3: board, bottom side, seen from below]

Size 406.4 x 95.25 mm. Coordinates in mm from the lower left corner, seen from the top.
Outline: 0,95.25 0,0 406.38,0 406.4,95.25 0,95.25
Copper layers (1*16): Top 0.035mm / dielectric 1.5mm / Bottom 0.035mm
Design rules "default": minimum track width 6mil, minimum drill 0.35mm, track to track 6mil, track to pad 6mil, pad to pad 6mil, via to via 6mil, smd to smd 6mil, copper to edge 40mil, drill to drill 6mil, minimum pad ring 10mil, minimum via ring 8mil, stop-mask expansion 4mil, vias tented up to drill 0mil, thermal gap 10mil
Holes 3.26 mm at 3.17,3.17 3.17,92.08 403.23,3.17 403.23,74.93

### Footprints (pad centres in the part's own frame; a part is rotated, then mirrored left to right if it is on the bottom)
SIP-100-04-32 = drill 0.813 pad 1.778 square: 1 -3.81,0 | drill 0.813 pad 1.778 octagon: 2 -1.27,0; 3 1.27,0; 4 3.81,0
BNC_VERTICAL = drill 0.89: P$1 0,0; P$2 2.54,0 | drill 2.01: P$3 5.08,5.08; P$4 -5.08,-5.08
C0805K = smd 1.3 x 1.6: 1 -1,0; 2 1,0
E2,5-5 = drill 0.813 pad 1.6: + -1.27,0 | drill 0.813 pad 1.6 octagon: - 1.27,0
DIODE_SMB = smd 2.4 x 2.4: A 2.2,0; C -2.2,0
SO14 = smd 0.66 x 2.032: 1 -3.81,-3.073; 2 -2.54,-3.073; 3 -1.27,-3.073; 4 0,-3.073; 5 1.27,-3.073; 6 2.54,-3.073; 7 3.81,-3.073; 8 3.81,3.073; 9 2.54,3.073; 10 1.27,3.073; 11 0,3.073; 12 -1.27,3.073; 13 -2.54,3.073; 14 -3.81,3.073
POWER_JACK_PTH = drill 2.997 pad 4.318: GND 0,7.7; GNDBREAK 4.7,10.7; PWR 0,13.7
10X02MTA = drill 1.016 long: 1 1.27,0; 2 -1.27,0
LED5MM = drill 0.813 pad 1.676 octagon: A -1.27,0; K 1.27,0
75869-16 = drill 1.016 square: 1 -8.89,-1.27 | drill 1.016 octagon: 2 -8.89,1.27; 3 -6.35,-1.27; 4 -6.35,1.27; 5 -3.81,-1.27; 6 -3.81,1.27; 7 -1.27,-1.27; 8 -1.27,1.27; 9 1.27,-1.27; 10 1.27,1.27; 11 3.81,-1.27; 12 3.81,1.27; 13 6.35,-1.27; 14 6.35,1.27; 15 8.89,-1.27; 16 8.89,1.27
R1206MP = smd 1.3 x 1.6: 1 -1.524,0; 2 1.524,0
M0805 = smd 1.3 x 1.6: 1 -0.95,0; 2 0.95,0
M1206 = smd 1.6 x 2: 1 -1.4,0; 2 1.4,0
R1206 = smd 1.4 x 1.8: 1 -1.329,0; 2 1.329,0
R0805 = smd 1.3 x 1.5: 1 -0.95,0; 2 0.95,0
SJ = smd 1.168 x 1.6: 1 -0.762,0; 2 0.762,0
SJ_2 = smd 1.168 x 1.6: 1 -1.524,0; 2 0,0; 3 1.524,0
TACT_PANA-EVQ = drill 1.3 pad 2.54: P$1 -3.25,0; P$2 3.25,0
SOT223 = smd 1.219 x 2.235: 1 -2.311,-3.099; 2 0,-3.099; 3 2.311,-3.099 | smd 3.6 x 2.2: 4 0,3.099
TEENSY_3.5/3.6 = drill 0.965: 0/RX -25.4,-7.62; 1/TX -22.86,-7.62; 2 -20.32,-7.62; 3/CANTX -17.78,-7.62; 3V3 7.62,-7.62; 3V3_2 17.78,-2.54; 3V3_LO -22.86,7.62; 4/CANRX -15.24,-7.62; 5 -12.7,-7.62; 6 -10.16,-7.62; 7 -7.62,-7.62; 8 -5.08,-7.62; 9/CS -2.54,-7.62; 10/CS 0,-7.62; 11/MOSI 2.54,-7.62; 12/MISO 5.08,-7.62; 13/SCK 5.08,7.62; 14/A0 2.54,7.62; 15/A1 0,7.62; 16/A2 -2.54,7.62; 17/A3 -5.08,7.62; 18/A4/SDA -7.62,7.62; 19/A5/SCL -10.16,7.62; 20/A6 -12.7,7.62; 21/A7 -15.24,7.62; 21/DAC0 12.7,7.62; 22/A8 -17.78,7.62; 23/A9 -20.32,7.62; 24 10.16,-7.62; 25 12.7,-7.62; 26 15.24,-7.62; 27 17.78,-7.62; 28 20.32,-7.62; 29 22.86,-7.62; 30 25.4,-7.62; 31/A12 27.94,-7.62; 32/A13 30.48,-7.62; 33/A14 30.48,7.62; 34/A15 27.94,7.62; 35/A16 25.4,7.62; 36/A17 22.86,7.62; 37/A18 20.32,7.62; 38/A19 17.78,7.62; 39/A20 15.24,7.62; A10 -17.78,5.08; A11 -15.24,5.08; A22/DAC1 10.16,7.62; AGND -25.4,7.62; AREF -20.32,5.08; GND -27.94,-7.62; GND2 7.62,7.62; GND3 17.78,0; PROG 17.78,2.54; RESET 17.78,5.08; U5V -21.59,-4.445; UD+ -16.51,-4.445; UD- -19.05,-4.445; UGND1 -13.97,-4.445; UGND2 -11.43,-4.445; VBAT 17.78,-5.08; VIN -27.94,7.62; VUSB -25.4,5.08
SO14' = smd 0.6 x 2.2: 1 -3.81,-2.6; 2 -2.54,-2.6; 3 -1.27,-2.6; 4 0,-2.6; 5 1.27,-2.6; 6 2.54,-2.6; 7 3.81,-2.6; 8 3.81,2.6; 9 2.54,2.6; 10 1.27,2.6; 11 0,2.6; 12 -1.27,2.6; 13 -2.54,2.6; 14 -3.81,2.6
SOT-223 = smd 1.219 x 2.235: 1 -2.311,-3.099; 2 0,-3.099; 3 2.311,-3.099 | smd 3.6 x 2.2: 4 0,3.099
SJW = smd 1.27 x 2.54: 1 -1.27,0; 2 1.27,0

### Placement (x,y rotation side)
ACC_A  132.72,87 270 bottom
ACC_B  278.13,87.63 270 bottom
AIN_A0  177.8,86.36 180 top
AIN_A1  177.8,60.96 180 top
AIN_A2  177.8,35.56 180 top
AIN_A3  177.8,10.16 180 top
AIN_B0  228.6,86.36 180 top
AIN_B1  228.6,60.96 180 top
AIN_B2  228.6,35.56 180 top
AIN_B3  228.6,10.16 180 top
C1  30.48,34.92 0 bottom
C2  107.31,38.1 90 bottom
C3  123.19,85.09 180 bottom
C4  285.12,34.29 270 bottom
C5  360.68,34.92 0 bottom
C6  316.23,85.72 180 bottom
CIN1  25.4,73.66 270 bottom
COUT1  17.78,73.66 270 bottom
D1  86.36,85.09 0 bottom
D2  64.77,85.09 0 bottom
D3  371.48,84.45 0 bottom
D4  351.15,84.45 0 bottom
DAC_A0  203.2,86.36 180 top
DAC_A1  203.2,60.96 180 top
DAC_B0  203.2,35.56 180 top
DAC_B1  203.2,10.16 180 top
DIO_A0  12.7,63.5 180 top
DIO_A1  38.1,63.5 180 top
DIO_A6  12.7,12.7 180 top
DIO_A7  38.1,12.7 180 top
DIO_A8  63.5,12.7 180 top
DIO_A9  88.9,12.7 180 top
DIO_A10  114.3,12.7 180 top
DIO_A11  139.7,12.7 180 top
DIO_B0  393.7,63.5 180 top
DIO_B1  368.3,63.5 180 top
DIO_B6  393.7,12.7 180 top
DIO_B7  368.3,12.7 180 top
DIO_B8  342.9,12.7 180 top
DIO_B9  317.5,12.7 180 top
DIO_B10  292.1,12.7 180 top
DIO_B11  266.7,12.7 180 top
IC1  38.1,38.1 180 bottom
IC2  114.3,38.1 180 bottom
IC3  368.3,38.1 180 bottom
IC4  292.1,38.1 180 bottom
J1  31.75,93.98 180 bottom
J2  85.72,90.81 180 bottom
J3  64.14,90.81 180 bottom
J4  350.52,90.17 180 bottom
J5  370.84,90.17 180 bottom
LED1  12.7,50.8 0 top
LED2  38.1,50.8 0 top
LED3  88.9,50.8 0 top
LED4  139.7,50.8 180 top
LED5  63.5,50.8 180 top
LED6  114.3,50.8 0 top
LED7  12.7,25.4 0 top
LED8  38.1,25.4 0 top
LED9  63.5,25.4 180 top
LED10  88.9,25.4 0 top
LED11  114.3,25.4 0 top
LED12  139.7,25.4 180 top
LED13  266.7,50.8 0 top
LED14  317.5,50.8 0 top
LED15  292.1,50.8 0 top
LED16  342.9,50.8 0 top
LED17  393.7,50.8 180 top
LED18  368.3,50.8 0 top
LED19  266.7,25.4 0 top
LED20  292.1,25.4 0 top
LED21  317.5,25.4 180 top
LED22  342.9,25.4 0 top
LED23  368.3,25.4 0 top
LED24  393.7,25.4 180 top
LED_PWR  13.97,90.17 90 top
LICK_A0  63.5,63.5 180 top
LICK_A0_IN  114.94,90.17 180 bottom
LICK_A0_LED  127,88.9 90 top
LICK_A1  114.3,63.5 180 top
LICK_A1_IN  107.31,90.17 180 bottom
LICK_A1_LED  95.25,88.9 90 top
LICK_B0  266.7,63.5 180 top
LICK_B0_IN  310.51,90.81 180 bottom
LICK_B0_LED  327.02,89.53 90 top
LICK_B1  317.5,63.5 180 top
LICK_B1_IN  302.89,90.81 180 bottom
LICK_B1_LED  287.02,89.53 90 top
P1  153.67,86.36 0 bottom
P2  252.73,86.36 0 bottom
R1  19.05,50.8 180 top
R2  43.43,49.28 90 top
R3  93.85,49.15 90 top
R4  132.97,50.8 0 top
R5  58.42,49.15 90 top
R6  120.65,48.9 90 top
R7  19.05,25.4 180 top
R8  43.18,26.92 270 top
R9  58.42,26.92 270 top
R10  95.89,25.4 180 top
R11  119.63,26.8 270 top
R12  133.99,26.67 270 top
R13  117.47,78.74 90 bottom
R14  120.65,78.74 270 bottom
R15  117.47,74.3 90 bottom
R16  113.67,74.3 270 bottom
R17  118.75,82.55 180 bottom
R18  104.39,78.74 270 bottom
R19  101.22,78.74 90 bottom
R20  105.41,74.3 90 bottom
R21  108.58,74.3 270 bottom
R22  104.01,82.55 0 bottom
R23  67.94,72.39 0 bottom
R24  92.08,72.39 0 bottom
R25  54.61,77.09 270 bottom
R26  76.83,76.45 270 bottom
R27  120.65,89.53 270 bottom
R28  100.33,88.27 270 bottom
R29  273.05,50.8 180 top
R30  317.25,45.47 0 top
R31  298.96,49.15 90 top
R32  349.63,50.8 180 top
R33  386.97,50.8 0 top
R34  373.38,49.53 90 top
R35  273.05,25.4 180 top
R36  297.18,26.92 270 top
R37  312.42,26.92 270 top
R38  349.88,25.4 180 top
R39  373.63,26.8 270 top
R40  386.71,25.4 0 top
R41  313.69,79.38 90 bottom
R42  316.87,79.38 90 bottom
R43  313.69,74.93 90 bottom
R44  309.25,74.93 270 bottom
R45  314.32,83.19 180 bottom
R46  299.97,79.38 270 bottom
R47  296.8,79.38 90 bottom
R48  300.99,74.93 90 bottom
R49  304.17,74.93 270 bottom
R50  299.59,83.19 0 bottom
R51  342.26,71.12 180 bottom
R52  362.58,71.12 180 bottom
R53  341,77.09 270 bottom
R54  361.31,76.83 270 bottom
R55  318.77,90.81 0 bottom
R56  294.64,90.81 180 bottom
RESET_A  139.7,76.83 180 bottom
RESET_B  266.7,76.83 180 bottom
RLED  13.97,82.55 270 bottom
SJ1  12.7,74.3 270 bottom
SJ_A  170.81,10.16 270 bottom
SJ_B  271.78,10.16 270 bottom
SOLN_A0  88.9,63.5 180 top
SOLN_A1  139.7,63.5 180 top
SOLN_B0  292.1,63.5 180 top
SOLN_B1  342.9,63.5 180 top
SW1  76.83,88.9 90 bottom
SW2  55.24,88.9 90 bottom
SW3  362.58,87 90 bottom
SW4  342.26,87 90 bottom
T1  84.45,77.47 90 bottom
T2  62.87,77.47 90 bottom
T3  369.57,76.83 90 bottom
T4  349.25,76.83 90 bottom
TEENSY_A  158.75,35.56 90 bottom
TEENSY_B  247.65,35.56 90 bottom
U1  LP339D  [SO14']  111.12,82.55 270 bottom
U2  LP339D  [SO14']  306.7,83.19 270 bottom
U3  21.59,83.19 0 bottom
VCC2_VCC1  207.01,6.99 0 bottom
VCC_OUT  393.7,85.72 180 top

### Tracks (layer width: path | path; a pad name or v marks a point on that pad's centre or on a via)
3V3_A
  Top 0.61: P1.9 152.4,83.82 151.45,82.87 143.83,82.87 138.43,88.27 137.79,88.27 137.16,88.27 ACC_A.2
  Bottom 0.61: P1.9 152.4,82.55 158.12,76.83 158.12,55.24 TEENSY_A.3V3_2
3V3_B
  Top 0.61: P2.9 251.46,81.28 268.61,81.28 276.23,88.9 ACC_B.2
  Bottom 0.61: P2.9 251.46,81.92 246.38,76.83 246.38,54.61 TEENSY_B.3V3_2
AGND_A  (via drill 0.35, 1)
  Top 0.406: 170.81,90.81 AIN_A0.P$2
  Top 0.61: v169.54,90.81 170.81,90.81 | v155.57,90.81 ACC_A.1
  Top 0.813: TEENSY_A.AGND AIN_A3.P$2
  Bottom 0.61: v169.54,90.81 v155.57,90.81
  other vias: 190.5,66.67 190.5,69.85 190.5,73.03
  pour Top (isolate 0.61): 173.46,7.72 195.27,7.72 195.28,49.53 195.28,49.57 195.28,49.57 195.28,49.57 195.28,49.6 195.3,49.65 195.3,49.65 195.3,49.65 195.32,49.68 195.34,49.72 195.34,49.72 195.34,49.72 195.36,49.75 195.39,49.77 195.39,49.77 195.39,49.77 195.45,49.8 195.46,49.81 195.46,49.81 195.46,49.81 195.51,49.83 195.54,49.83 195.54,49.83 195.54,49.83 195.58,49.83 207.98,49.83 207.98,87.34 191.77,87.53 173.46,87.53
AGND_B  (via drill 0.35, 1)
  Top 0.61: ACC_B.1 248.92,91.44 v248.28,90.81 | v240.03,90.81 238.06,88.84 228.54,88.84 AIN_B0.P$2
  Top 0.813: TEENSY_B.AGND 250.19,5.08 231.14,5.08 AIN_B3.P$2
  Bottom 0.61: v248.28,90.81 v240.03,90.81
  other vias: 215.9,66.67 215.9,69.85 215.9,73.03
  pour Top (isolate 0.61): 211.01,46.75 210.94,46.71 210.86,46.69 198.42,46.69 198.42,7.92 229.57,7.92 229.57,87.33 211.12,87.33 211.12,46.95 211.1,46.87 211.06,46.8
AIN_A0  (via drill 0.35)
  Top 0.406: v177.8,79.38 v177.8,73.03
  Bottom 0.406: v177.8,73.03 177.8,67.47 170.44,60.1 170.44,42.16 TEENSY_A.14/A0 | AIN_A0.P$1 v177.8,79.38
AIN_A1
  Bottom 0.406: AIN_A1.P$1 177.72,60.88 177.72,46.91 TEENSY_A.15/A1
AIN_A2
  Bottom 0.406: AIN_A2.P$1 175.26,33.02 TEENSY_A.16/A2
AIN_A3
  Bottom 0.406: AIN_A3.P$1 168.87,19.09 168.87,27.98 TEENSY_A.17/A3
AIN_A4  (via drill 0.35)
  Top 0.406: TEENSY_A.18/A4/SDA 162.56,31.75 162.56,67.94 156.84,73.66 v147.32,73.66 | v137.79,83.19 135.25,85.72 ACC_A.3
  Bottom 0.406: v147.32,73.66 147.32,74.3 138.43,83.19 v137.79,83.19
AIN_A5  (via drill 0.35)
  Top 0.406: TEENSY_A.19/A5/SCL 160.02,31.75 160.02,67.94 155.57,72.39 v139.06,72.39 | ACC_A.4 v132.72,80.01
  Bottom 0.406: v139.06,72.39 132.72,78.74 v132.72,80.01
AIN_B0  (via drill 0.35)
  Top 0.406: AIN_B0.P$1 228.6,74.3 v230.5,72.39
  Bottom 0.406: TEENSY_B.14/A0 243.84,49.53 235.94,49.53 230.5,54.97 v230.5,72.39
AIN_B1
  Bottom 0.406: TEENSY_B.15/A1 243.84,46.99 235.31,46.99 228.6,53.7 AIN_B1.P$1
AIN_B2
  Bottom 0.406: TEENSY_B.16/A2 254,34.29 229.87,34.29 AIN_B2.P$1
AIN_B3
  Bottom 0.406: TEENSY_B.17/A3 251.46,26.67 232.41,26.67 228.6,22.86 AIN_B3.P$1
AIN_B4  (via drill 0.35)
  Top 0.406: v280.04,68.58 262.25,50.8 v261.24,50.8
  Bottom 0.406: TEENSY_B.18/A4/SDA 261.24,33.91 v261.24,50.8 | ACC_B.3 278.76,86.36 280.04,85.09 v280.04,68.58
AIN_B5  (via drill 0.35)
  Top 0.406: v278.13,68.58 v262.64,53.09
  Bottom 0.406: TEENSY_B.19/A5/SCL 262.64,32.77 v262.64,53.09 | ACC_B.4 v278.13,68.58
DAC_A0  (via drill 0.35)
  Top 0.406: TEENSY_A.21/DAC0 168.91,50.8 v183.51,50.8 | DAC_A0.P$1 203.2,80.01 v193.04,69.85
  Bottom 0.406: v193.04,69.85 193.04,60.33 v183.51,50.8
DAC_A1  (via drill 0.35)
  Top 0.406: TEENSY_A.A22/DAC1 169.54,48.9 v185.42,48.9
  Bottom 0.406: v185.42,48.9 195.58,59.05 201.93,59.05 203.2,60.33 DAC_A1.P$1
DAC_B0  (via drill 0.35)
  Top 0.406: TEENSY_B.21/DAC0 254,46.99 v224.79,46.99
  Bottom 0.406: v224.79,46.99 213.36,35.56 DAC_B0.P$1
DAC_B1  (via drill 0.35)
  Top 0.406: TEENSY_B.A22/DAC1 254,44.45 v226.69,44.45
  Bottom 0.406: v226.69,44.45 203.2,20.95 DAC_B1.P$1
DIO_A0  (via drill 0.35)
  Top 0.406: DIO_A0.P$1 12.7,62.23 32.07,42.86 | 32.07,42.86 36.83,38.1 138.43,38.1 TEENSY_A.6 | v33.02,43.81 32.07,42.86
  Bottom 0.406: 34.29,41.91 IC1.1 34.29,42.44 33.02,43.71 v33.02,43.81
DIO_A1  (via drill 0.35)
  Top 0.406: TEENSY_A.7 139.7,39.37 41.27,39.37 v36.83,43.81
  Bottom 0.406: DIO_A1.P$1 38.1,57.78 34.92,54.61 34.92,46.99 36.83,45.09 v36.83,43.81 IC1.3
DIO_A6  (via drill 0.35)
  Top 0.406: DIO_A6.P$1 17.14,12.7 v35.56,31.11 41.27,36.83 137.16,36.83 TEENSY_A.5
  Bottom 0.406: v35.56,31.11 IC1.13
DIO_A7  (via drill 0.35)
  Top 0.406: TEENSY_A.4/CANRX 135.89,35.56 42.55,35.56 v38.1,31.11
  Bottom 0.406: 38.1,36.2 IC1.11 v38.1,31.11 38.1,29.84 34.29,26.04 34.29,16.51 DIO_A7.P$1
DIO_A8  (via drill 0.35)
  Top 0.406: TEENSY_A.20/A6 163.83,22.86 161.29,20.32 153.67,20.32 152.4,19.05 149.86,19.05 134.62,34.29 v68.58,34.29 43.18,34.29 v41.27,32.38
  Bottom 0.406: IC1.9 40.64,33.02 v41.27,32.38 | DIO_A8.P$1 63.5,18.41 68.58,23.5 v68.58,34.29
DIO_A9  (via drill 0.35)
  Top 0.406: DIO_A9.P$1 92.71,12.7 94.3,14.29 108.58,14.29 | TEENSY_A.21/A7 165.1,19.05 163.19,19.05 161.93,17.78 153.67,17.78 152.4,16.51 147.96,16.51 146.69,15.24 142.24,15.24 141.29,16.19 135.57,16.19 133.67,14.29 108.58,14.29 | v108.58,29.21 108.58,14.29
  Bottom 0.406: IC2.13 111.76,33.12 108.58,29.95 v108.58,29.21
DIO_A10
  Top 0.406: TEENSY_A.22/A8 165.1,16.51 163.19,16.51 161.93,15.24 153.67,15.24 152.4,13.97 141.6,13.97 140.97,14.61 135.89,14.61 133.99,12.7 DIO_A10.P$1
  Bottom 0.406: IC2.11 114.3,30.48 111.12,27.3 111.12,15.88 DIO_A10.P$1
DIO_A11
  Top 0.406: TEENSY_A.23/A9 162.56,11.43 140.97,11.43 DIO_A11.P$1
  Bottom 0.406: IC2.9 116.84,33.66 135.89,14.61 137.79,14.61 DIO_A11.P$1
DIO_A27
  Bottom 0.406: TEENSY_A.27 156.21,58.42 156.21,76.83 151.13,81.92 151.13,86.36 P1.12
DIO_A28
  Bottom 0.406: TEENSY_A.28 154.94,59.69 154.94,76.2 149.86,81.28 P1.11
DIO_A29
  Bottom 0.406: P1.14 148.59,86.36 148.59,80.64 153.67,75.56 153.67,60.96 TEENSY_A.29
DIO_A30
  Bottom 0.406: TEENSY_A.30 152.4,62.23 152.4,74.93 147.32,80.01 P1.13
DIO_A31
  Bottom 0.406: TEENSY_A.31/A12 149.54,65.09 149.54,73.98 143.51,80.01 143.51,86.36 P1.16
DIO_A32
  Bottom 0.406: P1.15 144.78,80.64 151.13,74.3 TEENSY_A.32/A13
DIO_A33
  Bottom 0.406: TEENSY_A.33/A14 166.37,83.82 P1.2
DIO_A34
  Bottom 0.406: P1.1 164.47,83.19 164.47,65.41 TEENSY_A.34/A15
DIO_A35
  Bottom 0.406: TEENSY_A.35/A16 168.28,62.87 168.28,83.82 162.56,89.53 160.66,89.53 160.02,88.9 P1.4
DIO_A36
  Bottom 0.406: TEENSY_A.36/A17 163.19,61.59 163.19,80.64 160.02,83.82 P1.3
DIO_A37
  Bottom 0.406: TEENSY_A.37/A18 161.93,60.33 161.93,79.38 158.75,82.55 158.75,86.36 P1.6
DIO_A38
  Bottom 0.406: TEENSY_A.38/A19 160.66,59.05 160.66,78.74 157.48,81.92 P1.5
DIO_A39
  Bottom 0.406: P1.8 156.21,86.36 156.21,81.28 159.38,78.11 159.38,57.78 162.56,54.61 162.56,51.44 163.19,50.8 TEENSY_A.39/A20
DIO_B0  (via drill 0.35)
  Top 0.406: TEENSY_B.6 246.38,31.75 256.54,31.75 262.25,37.47 363.22,37.47 v369.57,43.81 372.75,43.81 383.54,54.61 388.62,54.61 393.7,59.69 DIO_B0.P$1
  Bottom 0.406: IC3.5 v369.57,43.81
DIO_B1  (via drill 0.35)
  Top 0.406: TEENSY_B.7 246.38,34.29 256.54,34.29 260.99,38.73 361.95,38.73 v367.03,43.81 | DIO_B1.P$1 368.3,57.15 v361.95,50.8
  Bottom 0.406: IC3.3 v367.03,43.81 367.03,45.72 v361.95,50.8
DIO_B6  (via drill 0.35)
  Top 0.406: DIO_B6.P$1 373.06,33.34 | 373.06,33.34 370.2,36.2 263.52,36.2 256.54,29.21 246,29.21 240.03,23.24 TEENSY_B.5 | v372.11,32.38 373.06,33.34
  Bottom 0.406: IC3.9 370.84,33.66 v372.11,32.38
DIO_B7  (via drill 0.35)
  Top 0.406: 361.31,19.68 346.07,34.92 264.8,34.92 256.54,26.67 254,26.67 250.19,22.86 242.19,22.86 240.03,20.7 TEENSY_B.4/CANRX | 361.31,19.68 DIO_B7.P$1 | 361.31,19.68 v363.86,22.23
  Bottom 0.406: v363.86,22.23 363.86,25.4 368.3,29.84 IC3.11
DIO_B8  (via drill 0.35)
  Top 0.406: 337.82,33.66 345.44,33.66 v347.35,31.75 | 337.82,33.66 337.82,17.78 DIO_B8.P$1 | 337.82,33.66 266.06,33.66 TEENSY_B.20/A6
  Bottom 0.406: v347.35,31.75 364.49,31.75 365.76,33.02 IC3.13
DIO_B9  (via drill 0.35)
  Top 0.406: DIO_B9.P$1 297.81,32.38 294.64,32.38 | v294.64,31.11 294.64,32.38 | 294.64,32.38 267.33,32.38 TEENSY_B.21/A7
  Bottom 0.406: IC4.9 v294.64,31.11
DIO_B10  (via drill 0.35)
  Top 0.406: DIO_B10.P$1 283.21,21.59 | v287.02,25.4 283.21,21.59 | v258.44,19.05 260.99,21.59 283.21,21.59
  Bottom 0.406: 292.1,36.2 IC4.11 292.1,30.48 v287.02,25.4 | v258.44,19.05 257.18,17.78 TEENSY_B.22/A8
DIO_B11  (via drill 0.35)
  Top 0.406: 257.05,15.24 264.16,15.24 DIO_B11.P$1 | 257.05,15.24 257.05,20.19 267.97,31.11 v288.29,31.11 | 257.05,15.24 TEENSY_B.23/A9
  Bottom 0.406: IC4.13 289.56,32.38 v288.29,31.11
DIO_B27
  Bottom 0.406: TEENSY_B.27 245.11,58.42 245.11,77.47 250.19,82.55 250.19,86.36 P2.12
DIO_B28
  Bottom 0.406: TEENSY_B.28 243.84,59.69 243.84,78.11 248.92,83.19 P2.11
DIO_B29
  Bottom 0.406: TEENSY_B.29 242.57,60.96 242.57,78.74 247.65,83.82 247.65,86.36 P2.14
DIO_B30
  Bottom 0.406: TEENSY_B.30 241.3,62.23 241.3,79.38 246.38,84.45 P2.13
DIO_B31
  Bottom 0.406: TEENSY_B.31/A12 238.76,64.77 238.76,82.55 P2.16
DIO_B32
  Bottom 0.406: TEENSY_B.32/A13 240.03,81.28 P2.15
DIO_B33
  Bottom 0.406: TEENSY_B.33/A14 255.27,72.39 262.89,80.01 262.89,86.36 P2.2
DIO_B34
  Bottom 0.406: P2.1 261.62,80.64 254,73.03 254,64.77 TEENSY_B.34/A15
DIO_B35
  Bottom 0.406: TEENSY_B.35/A16 252.73,63.5 252.73,73.66 260.35,81.28 260.35,86.36 P2.4
DIO_B36
  Bottom 0.406: TEENSY_B.36/A17 251.46,62.23 251.46,74.3 259.08,81.92 P2.3
DIO_B37
  Bottom 0.406: TEENSY_B.37/A18 250.19,60.96 250.19,74.93 257.81,82.55 257.81,86.36 P2.6
DIO_B38
  Bottom 0.406: TEENSY_B.38/A19 248.92,59.69 248.92,75.56 256.54,83.19 P2.5
DIO_B39
  Bottom 0.406: TEENSY_B.39/A20 252.73,50.8 251.46,52.07 251.46,54.25 247.8,57.91 247.8,76.2 252.73,81.13 252.73,86.36 P2.8
GND  (via drill 1)
  other vias: 41.91,81.92 46.35,81.92 383.54,91.44 381,91.44
  pour Top (isolate 0.61, rank 2): -2.54,-2.54 408.31,-3.81 408.31,99.69 -3.17,99.06
  pour Bottom (isolate 0.305): -5.08,102.86 -5.08,-7.62 414.02,-5.72 414.02,104.77
LICK_A0
  Bottom 0.305: LICK_A0_IN.2 111.76,88.27 111.76,83.19 112.39,82.55 113.67,82.55 U1.4
  Bottom 0.406: R17.1 113.67,82.55
LICK_A1
  Bottom 0.406: U1.10 106.23,81.28 R22.1 104.96,89.09 LICK_A1_IN.2
LICK_B0
  Bottom 0.305: LICK_B0_IN.2 307.34,88.9 307.34,83.82 307.98,83.19 U2.4
  Bottom 0.406: U2.4 R45.1
LICK_B1
  Bottom 0.406: LICK_B1_IN.2 300.61,89.79 300.61,83.25 R50.1 301.81,81.92 U2.10
LICK_DETECT_A0  (via drill 0.35)
  Top 0.406: v115.95,85.09 v115.95,80.01 | v143.51,40.64 v124.46,40.64 v67.94,40.64 42.55,40.64 v39.37,43.81
  Bottom 0.406: U1.6 v115.95,80.01 117.16,80.01 R13.2 R14.1 121.61,79.69 124.46,76.83 v124.46,40.64 | U1.2 v115.95,85.09 | v143.51,40.64 TEENSY_A.25 | v39.37,43.81 IC1.5 | LICK_A0.P$1 67.94,59.05 v67.94,40.64
LICK_DETECT_A1  (via drill 0.35)
  Top 0.406: TEENSY_A.26 144.78,44.45 v115.57,44.45 | v106.17,85.09 106.17,77.92 v106.3,77.79
  Bottom 0.406: U1.8 107.58,77.79 v106.3,77.79 R18.2 | R18.2 R19.1 | U1.13 v106.17,85.09 | R18.2 103.76,77.16 103.76,72.14 110.49,65.41 112.39,65.41 LICK_A1.P$1 117.47,60.33 117.47,49.53 115.57,47.62 v115.57,44.45 IC2.5
LICK_DETECT_B0  (via drill 0.35)
  Top 0.406: v276.23,76.58 307.72,76.58 v311.53,80.39 v311.53,85.72 | 257.18,49.53 268.92,61.28 | 268.92,61.28 LICK_B0.P$1 | TEENSY_B.25 241.3,49.53 257.18,49.53 | v286.38,42.55 264.16,42.55 257.18,49.53 | v276.23,68.58 268.92,61.28
  Bottom 0.406: U2.2 v311.53,85.72 | 288.29,41.91 IC4.1 287.76,41.17 v286.38,42.55 | U2.6 309.56,80.39 v311.53,80.39 313.62,80.39 | 313.62,80.39 R41.2 313.75,80.26 | R42.1 316.16,78.42 314.2,80.39 313.62,80.39 | v276.23,76.58 v276.23,68.58
LICK_DETECT_B1  (via drill 0.35)
  Top 0.406: TEENSY_B.26 253.37,50.8 254.63,52.07 v257.81,52.07 | v301.75,85.72 v301.75,78.3 | LICK_B1.P$1 314.2,66.8 v299.47,66.8 299.47,56.9 v296.55,53.98 | v293.37,45.09 290.19,45.09 288.93,43.81 264.8,43.81 v259.08,49.53
  Bottom 0.406: 298.45,78.42 R46.2 300.1,78.3 v301.75,78.3 303.03,78.3 U2.8 | 298.45,78.42 R47.1 | U2.13 v301.75,85.72 | v299.47,66.8 299.47,74.93 298.45,75.95 298.45,78.42 | IC4.5 v293.37,45.09 296.55,48.26 v296.55,53.98 | v259.08,49.53 259.08,50.8 v257.81,52.07
N$1  (via drill 0.35)
  Top 0.406: R1.1 v22.86,50.8
  Bottom 0.406: IC1.2 35.56,44.45 29.21,50.8 v22.86,50.8
N$2  (via drill 0.35)
  Top 0.406: v38.1,45.72 40.13,47.75 R2.1
  Bottom 0.406: v38.1,45.72 IC1.4
N$3  (via drill 0.35)
  Top 0.406: R4.1 127.64,50.8 122.56,45.72 v114.3,45.72
  Bottom 0.406: IC2.4 v114.3,45.72
N$4  (via drill 0.35)
  Top 0.406: R3.1 102.87,47.62 v106.05,44.45
  Bottom 0.406: IC2.2 111.76,42.55 109.86,44.45 v106.05,44.45
N$5  (via drill 0.35)
  Top 0.406: v46.35,47.62 R5.1
  Bottom 0.406: IC1.6 40.64,43.18 45.09,47.62 v46.35,47.62
N$6  (via drill 0.35)
  Top 0.406: v118.36,47.37 R6.1
  Bottom 0.406: v118.36,47.37 116.84,45.85 IC2.6
N$7
  Top 0.61: LED1.K R1.2
N$8
  Top 0.61: R2.2 LED2.K
N$9
  Top 0.406: LED3.K 93.73,50.8 R3.2
N$10
  Top 0.61: R4.2 LED4.K
N$11
  Top 0.61: R5.2 LED5.K
N$12
  Top 0.406: LED6.K 120.27,50.8 R6.2
N$13
  Bottom 0.305: R21.1 108.9,75.25 110.49,76.83 110.49,80.01 | U1.11 109.86,82.55 110.49,81.92 110.49,80.01 | U1.9 110.49,80.01
  Bottom 0.406: U1.9 104.71,80.01 R18.1 | R20.2 R21.1
N$14
  Bottom 0.61: LED_PWR.A RLED.1
N$15  (via drill 0.35)
  Top 0.406: R7.1 v22.86,25.4
  Bottom 0.406: v22.86,25.4 31.75,25.4 36.83,30.48 IC1.12
N$16  (via drill 0.35)
  Top 0.406: v40.64,28.57 40.77,28.45 R8.1
  Bottom 0.406: v40.64,28.57 39.37,29.84 IC1.10
N$17  (via drill 0.35)
  Top 0.406: R9.1 50.8,28.45 v50.86,28.51
  Bottom 0.406: v50.86,28.51 44.35,35.03 IC1.8
N$18  (via drill 0.35)
  Top 0.406: v102.87,25.4 R10.1
  Bottom 0.305: 113.03,36.2 IC2.12
  Bottom 0.406: IC2.12 113.03,31.11 107.31,25.4 v102.87,25.4
N$19  (via drill 0.35)
  Top 0.406: v118.11,30.48 119.63,28.96 R11.1
  Bottom 0.406: IC2.10 115.57,33.02 v118.11,30.48
N$20  (via drill 0.35)
  Top 0.406: v133.99,30.48 R12.1
  Bottom 0.406: IC2.8 122.66,30.48 v133.99,30.48
N$21
  Top 0.61: R7.2 LED7.K
N$22
  Top 0.61: R8.2 LED8.K
N$23
  Top 0.61: R9.2 LED9.K
N$24
  Top 0.61: R10.2 LED10.K
N$25
  Top 0.61: LED11.K 115.7,25.27 R11.2
N$26
  Top 0.406: R12.2 138.18,25.15 LED12.K
N$27
  Bottom 0.305: U1.7 112.39,78.74 111.76,79.38 111.76,80.64 112.39,81.28 U1.5
  Bottom 0.406: U1.7 113.67,78.68 113.67,76.83 | 113.67,76.83 R16.1 | 113.67,76.83 117.47,76.83 | 117.47,76.83 R13.1 | 117.47,76.83 R15.2
N$28
  Bottom 0.61: TEENSY_A.3V3_LO 169.8,12.7 SJ_A.1
N$30
  Bottom 1.016: SJ1.1 17.65,75.06 COUT1.+ 17.78,80.09 | U3.3 17.78,80.09 | 17.78,80.09 15.48,80.09 RLED.2
N$31
  Bottom 0.61: 60.2,75.16 T2.1 | T2.1 62.64,75.16 65.41,72.39 R23.2 | R25.2 55.53,75.16 T2.1
N$32
  Bottom 0.406: 117.86,86.36 117.47,86.36 | 117.47,86.36 U1.1 | 117.47,86.36 119.32,88.21 R27.2
N$33
  Bottom 0.61: 81.78,75.16 T1.1 | T1.1 84.23,75.16 87,72.39 R24.2 | T1.1 76.94,75.16 R26.2
N$35
  Bottom 0.406: R27.1 126.31,90.86 LICK_A0_LED.K
N$38  (via drill 0.35)
  Top 0.406: v292.1,43.18 294,43.18 298.45,47.62 R31.1
  Bottom 0.406: IC4.4 v292.1,43.18
N$39  (via drill 0.35)
  Top 0.406: v296.55,43.81 297.81,42.55 312.8,42.55 R30.1
  Bottom 0.406: IC4.6 294.64,42.55 295.91,43.81 v296.55,43.81
N$40  (via drill 0.35)
  Top 0.406: v375.92,44.45 382.27,50.8 R33.1
  Bottom 0.406: IC3.6 370.84,42.44 372.11,43.71 375.18,43.71 v375.92,44.45
N$41
  Bottom 0.406: LICK_A1_LED.K 99.75,90.17 R28.1
N$42  (via drill 0.35)
  Top 0.406: R34.1 371.22,48.01 v368.3,45.09
  Bottom 0.406: v368.3,45.09 IC3.4
N$44  (via drill 0.35)
  Top 0.406: v106.05,86.87 105.92,87 v102.87,87
  Bottom 0.406: U1.14 106.55,86.36 v106.05,86.87 | v102.87,87 102.81,86.94 R28.2
N$46
  Bottom 0.61: TEENSY_B.3V3_LO 256.54,12.7 258.44,14.61 268.86,14.61 SJ_B.1
N$93  (via drill 0.35)
  Top 0.406: v353.06,50.8 R32.1
  Bottom 0.406: IC3.2 365.76,44.45 359.41,50.8 v353.06,50.8
N$96
  Top 0.406: R30.2 LED14.K
N$97
  Top 0.406: R31.2 293.5,50.67 LED15.K
N$98
  Top 0.61: R32.2 LED16.K
N$99
  Top 0.406: R33.2 LED17.K
N$100
  Top 0.61: R34.2 372.75,50.8 LED18.K
N$102  (via drill 0.35)
  Top 0.406: v287.65,27.94 285.12,25.4 R35.1
  Bottom 0.406: IC4.12 290.83,31.11 v287.65,27.94
N$103  (via drill 0.35)
  Top 0.406: v294.64,28.57 294.77,28.45 R36.1
  Bottom 0.406: v294.64,28.57 293.37,29.84 IC4.10
N$104  (via drill 0.35)
  Top 0.406: R37.1 304.8,28.45 v304.86,28.51
  Bottom 0.406: v304.86,28.51 298.35,35.03 IC4.8
N$105  (via drill 0.35)
  Top 0.406: v353.69,25.4 R38.1
  Bottom 0.305: 367.03,36.2 IC3.12
  Bottom 0.406: IC3.12 367.03,31.11 361.31,25.4 v353.69,25.4
N$106  (via drill 0.35)
  Top 0.406: v372.11,30.48 373.63,28.96 R39.1
  Bottom 0.406: IC3.10 369.57,33.02 v372.11,30.48
N$107  (via drill 0.35)
  Top 0.406: v382.9,25.4 R40.1
  Bottom 0.406: IC3.8 381.74,25.4 v382.9,25.4
N$108
  Top 0.61: R35.2 LED19.K
N$109
  Top 0.61: R36.2 LED20.K
N$110
  Top 0.61: R37.2 LED21.K
N$111
  Top 0.61: R38.2 LED22.K
N$112
  Top 0.61: R39.2 LED23.K
N$113
  Top 0.61: R40.2 LED24.K
N$115
  Bottom 0.61: T4.1 343.54,74.52 | 343.54,74.52 342.16,74.52 R53.2 | 343.54,74.52 343.67,74.39 R51.2
N$116
  Bottom 0.61: T3.1 363.86,74.52 | 363.86,74.52 362.23,74.52 R54.2 | R52.2 363.86,71.25 363.86,74.52
N$117  (via drill 0.35)
  Top 0.406: R29.1 275.84,50.8 279.65,46.99 v287.65,46.99
  Bottom 0.406: v287.65,46.99 289.56,45.09 IC4.2
N$118
  Top 0.61: LED13.K R29.2
N$119
  Bottom 0.305: U2.5 307.98,81.92 307.34,81.28 307.34,80.01 307.98,79.38 U2.7
  Bottom 0.406: U2.7 309.31,77.09 | 309.31,77.09 309.31,75.94 R44.1 | R41.1 313.69,77.09 | 313.69,77.09 R43.2 | 313.69,77.09 309.31,77.09
N$128
  Bottom 0.406: R46.1 300.29,80.64 U2.9 304.23,80.77 306.07,80.77 | R48.2 R49.1 305.24,75.88 306.07,76.71 306.07,80.77 | 306.07,80.77 306.07,82.55 305.44,83.19 U2.11
N$132
  Bottom 0.406: R55.2 314.9,88.27 310.57,88.27 U2.1
N$133
  Bottom 0.406: LICK_B0_LED.K R55.1
N$134
  Bottom 0.406: R56.1 LICK_B1_LED.K
N$135  (via drill 0.35)
  Top 0.406: v301.88,87.76 v299.08,87.76
  Bottom 0.406: v299.08,87.76 296.04,90.8 R56.2 | U2.14 302.64,87 v301.88,87.76
RESET_A
  Top 0.406: TEENSY_A.RESET 163.83,69.22 158.12,74.93 142.88,74.93 RESET_A.1
RESET_B  (via drill 0.35)
  Top 0.406: TEENSY_B.RESET 252.73,67.31 254.63,69.22 v267.97,69.22
  Bottom 0.406: v267.97,69.22 RESET_B.1
SOLN_A0  (via drill 0.35)
  Top 0.406: SOLN_A0.P$1 v109.22,43.18 110.49,41.91 149.86,41.91 TEENSY_A.12/MISO
  Bottom 0.406: SOLN_A0.P$1 80.01,72.39 R23.1 | v109.22,43.18 109.22,43.08 110.49,41.81 IC2.1
SOLN_A1  (via drill 0.35)
  Top 0.406: TEENSY_A.24 148.59,43.18 v135.89,43.18 v113.03,43.18 97.79,58.42 v97.79,69.85
  Bottom 0.406: IC2.3 v113.03,43.18 | v97.79,69.85 95.25,72.39 R24.1 | v135.89,43.18 135.89,52.7 139.7,56.52 SOLN_A1.P$1
SOLN_B0  (via drill 0.35)
  Top 0.406: 290.83,41.27 258.44,41.27 256.54,39.37 241.3,39.37 TEENSY_B.12/MISO | v290.83,43.81 290.83,41.27 | 290.83,41.27 326.39,41.27 v332.74,47.62
  Bottom 0.406: SOLN_B0.P$1 295.27,60.33 295.27,48.9 290.83,44.45 v290.83,43.81 IC4.3 | R51.1 332.74,62.99 v332.74,47.62
SOLN_B1  (via drill 0.35)
  Top 0.406: SOLN_B1.P$1 342.9,59.05 339.09,55.24 339.09,40.01 | 339.09,40.01 259.71,40.01 256.54,36.83 252.09,36.83 v250.82,38.1 | 339.09,40.01 361.31,40.01 v362.58,41.27
  Bottom 0.406: R52.1 353.56,63.5 SOLN_B1.P$1 | IC3.1 364.49,41.27 v362.58,41.27 | v250.82,38.1 243.21,45.72 TEENSY_B.24
VCC_1  (via drill 0.35, 1)
  Top 0.406: LICK_A0_LED.A 124.46,85.09 v119,85.09 | v107.82,50.8 LED6.A
  Top 0.61: LED8.A 40.01,22.23 62.23,22.23 64.77,24.77 LED9.A | v29.46,47.88 32.38,50.8 LED2.A | 113.67,73.03 119,73.03 119,75.56 | 113.67,73.03 108.58,73.03 | 108.58,73.03 v102.23,73.03 102.23,75.56 v97.79,80.01 95.25,82.55 LICK_A1_LED.A | v108.58,71.75 108.58,73.03 | 113.67,73.03 v113.67,71.75 | v119,85.09 119,75.56 | v121.28,75.56 119,75.56
  Bottom 0.406: R22.2 101.22,80.71 R19.2 98.11,79.69 v97.79,80.01 | v46.35,76.83 46.35,60.33 LED2.A | v119,85.09 117.73,85.09 116.46,83.82 U1.3 | v121.28,75.56 120.65,76.2 R14.2 | R16.2 v113.67,71.75 | 119.76,85.09 119.69,85.02 R17.2 | LED4.A LED12.A | v107.82,50.8 102.23,50.8 | v108.58,71.75 R21.2
  Bottom 0.61: 36.83,51.44 LED2.A | 110.39,34.92 IC2.14 107.31,35.03 | 17.14,53.98 13.34,53.98 11.43,52.07 LED1.A | 17.14,38.1 17.14,32.38 11.43,26.67 LED7.A | v29.46,47.88 27.94,46.35 27.94,38.1 | LED9.A 64.77,38.1 LED5.A | 118.11,4.45 118.11,12.7 113.03,17.78 LED11.A | 141.6,4.45 141.6,24.77 LED12.A | 103.5,38.1 106.58,35.03 107.31,35.03 | C2.1 107.31,35.03 | C1.1 31.58,35.03 33.02,35.03 | 33.02,35.03 IC1.14 | 33.02,35.03 33.02,38.1 | C3.1 119.76,85.09 v119,85.09 | LED3.A 87.63,36.83 | v102.23,73.03 102.23,50.8 102.23,38.1
  Bottom 1.016: 87.63,38.1 64.77,38.1 33.02,38.1 27.94,38.1 17.14,38.1 17.14,53.98 17.14,62.87 12.7,67.31 SJ1.2 | 87.63,38.1 102.23,38.1 103.5,38.1 | 87.63,38.1 87.63,36.83 LED10.A 87.63,17.14 100.33,4.45 118.11,4.45 141.6,4.45 168.28,4.45 170.81,1.91 174.62,1.91 178.44,5.71 178.44,8.26 | VCC2_VCC1.2 204.47,8.26 178.44,8.26 | 178.44,8.26 173.99,8.26 172.09,10.16 SJ_A.2
VCC_2  (via drill 0.35, 1)
  Top 0.406: v294.89,74.04 294.95,73.98 v306.7,73.98 310.2,73.98 317.82,81.6 | v294.89,80.39 LICK_B1_LED.A | LICK_B0_LED.A 324.49,88.27 317.82,81.6 | v313.69,85.72 317.82,81.6 | v359.41,41.91 359.41,43.18 LED18.A
  Top 0.61: LED23.A 363.22,25.4 v361.31,23.5
  Bottom 0.406: 294.96,80.33 R47.2 296.55,80.58 296.55,82.55 297.18,83.19 R50.2 | 294.96,80.33 v294.89,80.39 | 308.93,73.98 R44.2 v306.7,73.98 R49.2 | U2.3 311.79,84.45 313.06,85.72 v313.69,85.72 C6.1 315.23,83.23 | 315.23,83.23 R45.2 | R42.2 315.23,81.96 315.23,83.23 | v294.89,74.04 294.89,80.26 294.96,80.33 | LED14.A 311.79,50.8 | LED15.A 282.57,50.8 | LED13.A 267.97,48.26 282.57,48.26
  Bottom 0.61: v361.31,23.5 343.54,23.5 LED22.A 341.63,38.1 LED16.A | LED19.A 265.43,24.77 267.33,22.86 282.57,22.86 288.29,22.86 LED20.A | v359.41,41.91 359.41,38.1 | LED21.A 318.77,38.1 | 311.79,38.1 311.79,50.8 311.79,53.98 306.7,59.05 v306.7,73.98 | C4.1 287.02,35.29 | 287.02,35.29 288.03,35.29 IC4.14 | 287.02,35.29 287.02,38.1 | IC3.14 363.22,35.03 | 363.22,35.03 361.78,35.03 C5.1 | 363.22,35.03 363.22,38.1 | SJ_B.2 273.69,10.16 276.54,7.3 | LED17.A 396.88,50.8
  Bottom 1.016: 282.57,50.8 282.57,48.26 282.57,38.1 | 282.57,38.1 282.57,22.86 282.57,13.34 276.54,7.3 273.69,4.45 227.97,4.45 224.16,8.26 210.19,8.26 208.91,6.99 VCC2_VCC1.1 | 282.57,38.1 287.02,38.1 311.79,38.1 318.77,38.1 341.63,38.1 359.41,38.1 363.22,38.1 396.88,38.1 | 396.88,38.1 396.88,50.8 396.88,64.77 393.7,67.94 VCC_OUT.P$1 393.7,87.63 389.89,91.44 v386.08,91.44 | 396.88,38.1 396.88,27.3 LED24.A
VIN  (via drill 1)
  Top 0.61: v378.46,91.44 377.19,90.17 J5.1
  Top 1.016: v173.35,76.2 161.29,76.2 157.48,80.01 138.43,80.01 123.83,65.41 105.41,65.41 95.89,74.93 87,74.93 | J2.1 87,74.93 | J3.1 65.41,74.93 | 87,74.93 65.41,74.93 | 65.41,74.93 41.91,74.93 | 41.91,74.93 37.1,74.93 J1.PWR | v41.91,76.83 41.91,74.93 | v233.68,76.2 247.01,76.2 251.46,71.75 351.79,71.75 | J5.1 372.11,81.92 361.95,71.75 351.79,71.75 | J4.1 351.79,71.75
  Bottom 1.016: v233.68,76.2 v173.35,76.2 | J2.1 88.56,89.24 D1.C | J3.1 66.97,89.24 D2.C | J5.1 373.68,88.61 D3.C | J4.1 353.36,88.61 D4.C | J1.PWR 25.4,80.28 | 25.4,80.28 24.09,80.28 U3.1 | CIN1.+ 25.4,80.28
VIN_A
  Bottom 0.61: TEENSY_A.VIN 168.91,7.62 169.93,8.64 SJ_A.3
VIN_B
  Bottom 0.61: TEENSY_B.VIN 256.54,7.62 259.08,10.16 268.61,10.16 270.13,8.64 SJ_B.3
VOUT-2
  Bottom 1.016: T1.2 83.82,77.47 | 83.82,77.47 T1.4 | D1.A 77.39,85.09 SW1.P$1 | J2.2 84.45,85.39 D1.A | D1.A 84.16,77.81 83.82,77.47
VOUT-3
  Bottom 1.016: T2.2 62.87,77.47 | 62.87,77.47 T2.4 | J3.2 62.87,85.39 D2.A | D2.A 62.57,77.77 62.87,77.47 | D2.A 55.8,85.09 SW2.P$1
VOUT-5
  Bottom 1.016: T4.2 348.62,76.83 | 348.62,76.83 T4.4 | 349.21,90.25 349.21,90.21 J4.2 349.25,84.75 D4.A 348.95,83.19 | 348.95,83.19 348.95,77.17 348.62,76.83 | SW4.P$1 342.82,83.19 348.95,83.19
VOUT-6
  Bottom 1.016: D3.A 369.57,84.16 J5.2 | T3.2 369.32,76.83 | 369.32,76.83 T3.4 | D3.A 363.3,84.45 SW3.P$1 | 369.32,76.83 369.27,76.88 D3.A

### Text on the board
bNames: AGND | AGND | VIN | GND | GND | VCC_2 | 3V3_A | 3V3_B | AIN_A4 | AIN_B4 | GND | AIN_A5 | AIN_B5 | AGND_A | AGND_B | VIN | VCC_1 | For USB or external power, / jumper SJ_A and SJ_B to VIN | 3V3_A | 3V3_B | VIN_A | VIN_B | Teensy Breakout A2a / PVG 11/2021